# Altium project 200130 Precharge Controller R2.PrjPcb (part 1 of 2)
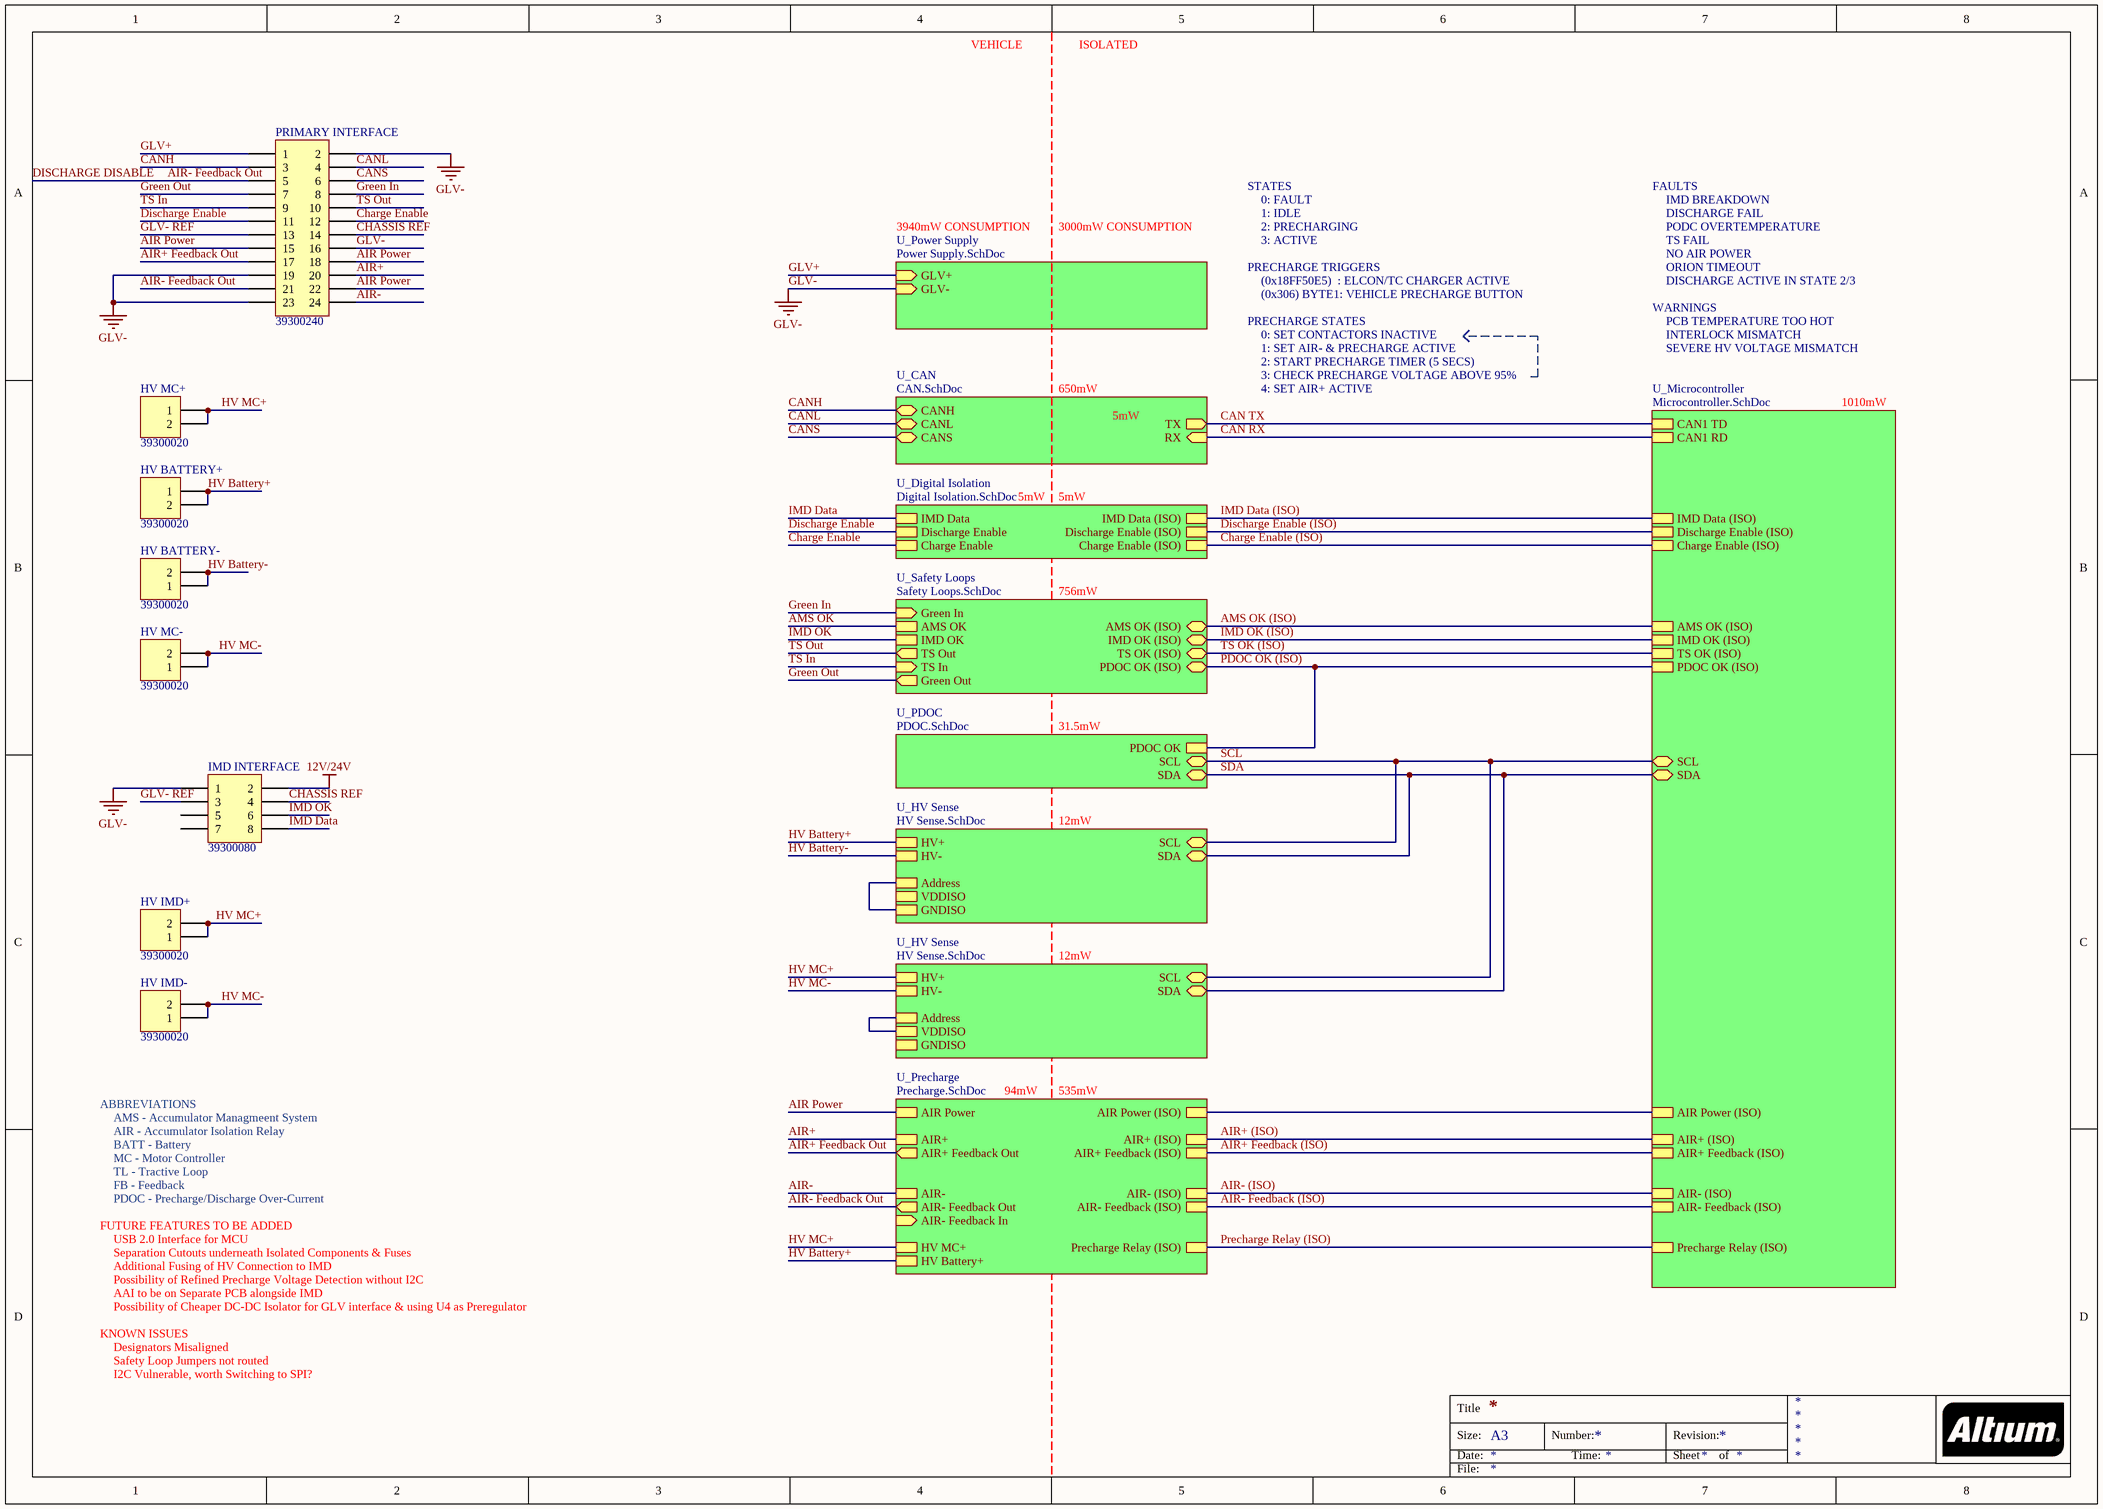
[diagram p0: Top Level.SchDoc]
9 sheets, 242 parts. Net scope: hierarchical (ports join the sheet entries above them; power ports are global).
Board file: 191228 PCB.PcbDoc
Sheets:
  Top Level.SchDoc
    U_CAN = CAN.SchDoc
    U_Power Supply = Power Supply.SchDoc
    U_Safety Loops = Safety Loops.SchDoc
    U_HV Sense = HV Sense.SchDoc
    U_HV Sense = HV Sense.SchDoc
    U_Precharge = Precharge.SchDoc
    U_PDOC = PDOC.SchDoc
    U_Digital Isolation = Digital Isolation.SchDoc
    U_Microcontroller = Microcontroller.SchDoc

## Sheet Top Level.SchDoc
size A3

### Parts
HV_BATTERY+  39300020  [39300020]
HV_BATTERY-  39300020  [39300020]
HV_IMD+  39300020  [39300020]
HV_IMD-  39300020  [39300020]
HV_MC+  39300020  [39300020]
HV_MC-  39300020  [39300020]
IMD_INTERFACE  39300080  [39300080]
PRIMARY_INTERFACE  39300240  [39300240]

### Sub-sheets
U_CAN = CAN.SchDoc: CANH (bidir), CANL (bidir), CANS (bidir), RX (in), TX (out)
U_Digital Isolation = Digital Isolation.SchDoc: IMD Data, Discharge Enable, Charge Enable, IMD Data (ISO), Discharge Enable (ISO), Charge Enable (ISO)
U_HV Sense = HV Sense.SchDoc: HV+, HV-, SCL (bidir), SDA (bidir), Address, VDDISO, GNDISO
U_HV Sense = HV Sense.SchDoc: HV+, HV-, SCL (bidir), SDA (bidir), Address, VDDISO, GNDISO
U_Microcontroller = Microcontroller.SchDoc: AIR- Feedback (ISO), AIR+ Feedback (ISO), AIR- (ISO), Precharge Relay (ISO), AIR+ (ISO), CAN1 TD, IMD OK (ISO), PDOC OK (ISO), AMS OK (ISO), TS OK (ISO), CAN1 RD, IMD Data (ISO), Discharge Enable (ISO), Charge Enable (ISO), SCL (bidir), SDA (bidir), AIR Power (ISO)
U_PDOC = PDOC.SchDoc: PDOC OK, SCL (bidir), SDA (bidir)
U_Power Supply = Power Supply.SchDoc: GLV+ (in), GLV- (in)
U_Precharge = Precharge.SchDoc: AIR Power, AIR- (ISO), AIR- Feedback Out (out), AIR- Feedback (ISO), AIR-, AIR- Feedback In (in), AIR+, AIR+ Feedback Out (out), AIR+ (ISO), AIR+ Feedback (ISO), Precharge Relay (ISO), HV MC+, HV Battery+, AIR Power (ISO)
U_Safety Loops = Safety Loops.SchDoc: AMS OK, IMD OK (ISO) (bidir), AMS OK (ISO) (bidir), PDOC OK (ISO) (bidir), TS OK (ISO) (bidir), Green In (in), IMD OK, TS Out (out), TS In (in), Green Out (out)

### Nets
12V/24V: IMD_INTERFACE.2
AIR Power: PRIMARY_INTERFACE.15 PRIMARY_INTERFACE.18 PRIMARY_INTERFACE.22 ; sheet U_Precharge/AIR Power
GLV-: IMD_INTERFACE.1 PRIMARY_INTERFACE.2 PRIMARY_INTERFACE.16 PRIMARY_INTERFACE.19 PRIMARY_INTERFACE.23 ; sheet U_Power Supply/GLV-
HV Battery-: HV_BATTERY-.1 HV_BATTERY-.2 HV_IMD-.1 HV_IMD-.2 HV_MC-.1 HV_MC-.2 ; sheet U_HV Sense/HV-, sheet U_HV Sense/Address, sheet U_HV Sense/GNDISO, sheet U_HV Sense/HV-, sheet U_HV Sense/GNDISO  [also labelled HV MC-]
TS In: PRIMARY_INTERFACE.9 ; sheet U_Safety Loops/TS In
VDDISO: sheet U_HV Sense/VDDISO, sheet U_HV Sense/Address, sheet U_HV Sense/VDDISO
AIR+: PRIMARY_INTERFACE.20 ; sheet U_Precharge/AIR+
AIR+ (ISO): sheet U_Precharge/AIR+ (ISO), sheet U_Microcontroller/AIR+ (ISO)
AIR+ Feedback (ISO): sheet U_Precharge/AIR+ Feedback (ISO), sheet U_Microcontroller/AIR+ Feedback (ISO)
AIR+ Feedback Out: PRIMARY_INTERFACE.17 ; sheet U_Precharge/AIR+ Feedback Out
AIR-: PRIMARY_INTERFACE.24 ; sheet U_Precharge/AIR-
AIR- (ISO): sheet U_Precharge/AIR- (ISO), sheet U_Microcontroller/AIR- (ISO)
AIR- Feedback (ISO): sheet U_Precharge/AIR- Feedback (ISO), sheet U_Microcontroller/AIR- Feedback (ISO)
AIR- Feedback Out: PRIMARY_INTERFACE.5 PRIMARY_INTERFACE.21 ; sheet U_Precharge/AIR- Feedback Out  [also labelled DISCHARGE DISABLE]
AMS OK: sheet U_Safety Loops/AMS OK
AMS OK (ISO): sheet U_Safety Loops/AMS OK (ISO), sheet U_Microcontroller/AMS OK (ISO)
CAN RX: sheet U_CAN/RX, sheet U_Microcontroller/CAN1 RD
CAN TX: sheet U_CAN/TX, sheet U_Microcontroller/CAN1 TD
CANH: PRIMARY_INTERFACE.3 ; sheet U_CAN/CANH
CANL: PRIMARY_INTERFACE.4 ; sheet U_CAN/CANL
CANS: PRIMARY_INTERFACE.6 ; sheet U_CAN/CANS
Charge Enable: PRIMARY_INTERFACE.12 ; sheet U_Digital Isolation/Charge Enable
Charge Enable (ISO): sheet U_Digital Isolation/Charge Enable (ISO), sheet U_Microcontroller/Charge Enable (ISO)
CHASSIS REF: IMD_INTERFACE.4 PRIMARY_INTERFACE.14
Discharge Enable: PRIMARY_INTERFACE.11 ; sheet U_Digital Isolation/Discharge Enable
Discharge Enable (ISO): sheet U_Digital Isolation/Discharge Enable (ISO), sheet U_Microcontroller/Discharge Enable (ISO)
GLV+: PRIMARY_INTERFACE.1 ; sheet U_Power Supply/GLV+
GLV- REF: IMD_INTERFACE.3 PRIMARY_INTERFACE.13
Green In: PRIMARY_INTERFACE.8 ; sheet U_Safety Loops/Green In
Green Out: PRIMARY_INTERFACE.7 ; sheet U_Safety Loops/Green Out
HV Battery+: HV_BATTERY+.1 HV_BATTERY+.2 ; sheet U_HV Sense/HV+, sheet U_Precharge/HV Battery+
HV MC+: HV_IMD+.1 HV_IMD+.2 HV_MC+.1 HV_MC+.2 ; sheet U_HV Sense/HV+, sheet U_Precharge/HV MC+
IMD Data: IMD_INTERFACE.8 ; sheet U_Digital Isolation/IMD Data
IMD Data (ISO): sheet U_Digital Isolation/IMD Data (ISO), sheet U_Microcontroller/IMD Data (ISO)
IMD OK: IMD_INTERFACE.6 ; sheet U_Safety Loops/IMD OK
IMD OK (ISO): sheet U_Safety Loops/IMD OK (ISO), sheet U_Microcontroller/IMD OK (ISO)
PDOC OK (ISO): sheet U_Safety Loops/PDOC OK (ISO), sheet U_PDOC/PDOC OK, sheet U_Microcontroller/PDOC OK (ISO)
Precharge Relay (ISO): sheet U_Precharge/Precharge Relay (ISO), sheet U_Microcontroller/Precharge Relay (ISO)
SCL: sheet U_HV Sense/SCL, sheet U_HV Sense/SCL, sheet U_PDOC/SCL, sheet U_Microcontroller/SCL
SDA: sheet U_HV Sense/SDA, sheet U_HV Sense/SDA, sheet U_PDOC/SDA, sheet U_Microcontroller/SDA
TS OK (ISO): sheet U_Safety Loops/TS OK (ISO), sheet U_Microcontroller/TS OK (ISO)
TS Out: PRIMARY_INTERFACE.10 ; sheet U_Safety Loops/TS Out
NetAIR_POW_TP1_1: sheet U_Precharge/AIR Power (ISO), sheet U_Microcontroller/AIR Power (ISO)

Not connected (* = marked no-connect by the designer): IMD_INTERFACE 5 7

### Notes on the sheet
- VEHICLE
- ISOLATED
- 3940mW CONSUMPTION
- 3000mW CONSUMPTION
- STATES
- 0: FAULT
- 1: IDLE
- 2: PRECHARGING
- 3: ACTIVE
- FAULTS
- IMD BREAKDOWN
- DISCHARGE FAIL
- PODC OVERTEMPERATURE
- TS FAIL
- PRECHARGE TRIGGERS
- (0x18FF50E5)  : ELCON/TC CHARGER ACTIVE
- (0x306) BYTE1: VEHICLE PRECHARGE BUTTON
- WARNINGS
- NO AIR POWER
- ORION TIMEOUT
- DISCHARGE ACTIVE IN STATE 2/3
- PRECHARGE STATES
- 1: SET AIR- & PRECHARGE ACTIVE
- 2: START PRECHARGE TIMER (5 SECS)
- 3: CHECK PRECHARGE VOLTAGE ABOVE 95%
- 0: SET CONTACTORS INACTIVE
- PCB TEMPERATURE TOO HOT
- INTERLOCK MISMATCH
- SEVERE HV VOLTAGE MISMATCH
- 650mW
- 5mW
- 4: SET AIR+ ACTIVE
- 1010mW
- 756mW
- 31.5mW
- 12mW
- ABBREVIATIONS
- AMS - Accumulator Managmeent System
- 94mW
- 535mW
- TL - Tractive Loop
- FB - Feedback
- BATT - Battery
- MC - Motor Controller
- AIR - Accumulator Isolation Relay
- FUTURE FEATURES TO BE ADDED
- PDOC - Precharge/Discharge Over-Current
- USB 2.0 Interface for MCU
- Separation Cutouts underneath Isolated Components & Fuses
- Additional Fusing of HV Connection to IMD
- Possibility of Refined Precharge Voltage Detection without I2C
- AAI to be on Separate PCB alongside IMD
- Possibility of Cheaper DC-DC Isolator for GLV interface & using U4 as Preregulator
- KNOWN ISSUES
- Designators Misaligned
- Safety Loop Jumpers not routed
- I2C Vulnerable, worth Switching to SPI?
- Title
- Size:
- Date:
- A3
- Number:
- Time:
- Revision:
- Sheet
- of
- File:

### Library data of the parts
HV_BATTERY+ HV_BATTERY- HV_IMD+ HV_IMD- HV_MC+ HV_MC- = 39300020: Positions: 2; Pitch: 4.2mm; Row Spacing: 5.5mm; Angle: 90; Flange: No; Contact: Tin; Part Number: 39300020; Digikey Part Number: WM21351-ND
IMD_INTERFACE = 39300080: Positions: 8; Pitch: 4.2mm; Row Spacing: 5.5mm; Angle: 90; Flange: No; Contact: Tin; Part Number: 39300080; Digikey Part Number: WM21354-ND
PRIMARY_INTERFACE = 39300240: Positions: 24; Pitch: 4.2mm; Row Spacing: 5.5mm; Angle: 90; Flange: No; Contact: Tin; Part Number: 39300240; Digikey Part Number: WM21362-ND

## Sheet CAN.SchDoc
size A4
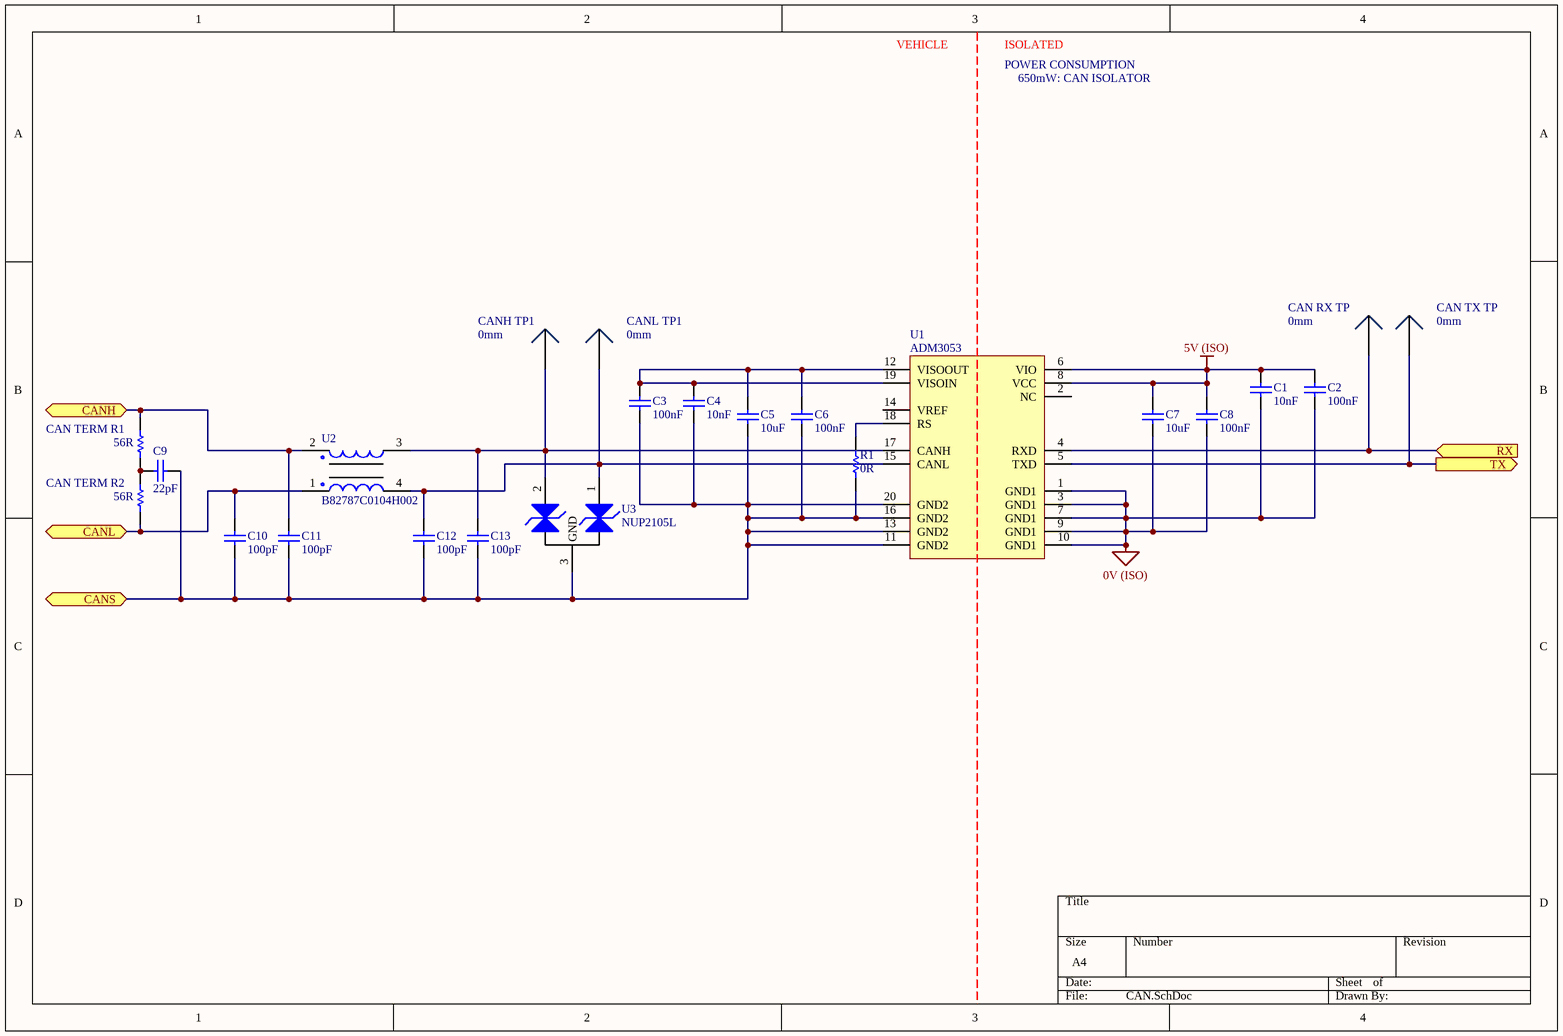
[diagram p1: CAN.SchDoc]

### Parts
C1  10nF  [1206]
C2  100nF  [0805]
C3  100nF  [0805]
C4  10nF  [1206]
C5  10uF  [0805]
C6  100nF  [0805]
C7  10uF  [0805]
C8  100nF  [0805]
C9  22pF  [0805]
C10  100pF  [0805]
C11  100pF  [0805]
C12  100pF  [0805]
C13  100pF  [0805]
CAN_RX_TP  0mm  [SMD Test Point]
CAN_TERM_R1  56R  [0805]
CAN_TERM_R2  56R  [0805]
CAN_TX_TP  0mm  [SMD Test Point]
CANH_TP1  0mm  [SMD Test Point]
CANL_TP1  0mm  [SMD Test Point]
R1  0R  [0805]
U1  ADM3053  [AD SOIC-W 20]
U2  B82787C0104H002  [TDK 4-PC Pad]
U3  NUP2105L  [ON SOT-23 BJT]

### Ports
CANH (bidir), CANL (bidir), CANS (bidir), RX (in), TX (out)

### Nets
0V (ISO): C1.1 C2.1 C7.1 C8.1 U1.1(GND1) U1.3(GND1) U1.7(GND1) U1.9(GND1) U1.10(GND1)
5V (ISO): C1.2 C2.2 C7.2 C8.2 U1.6(VIO) U1.8(VCC)
CAN RX: CAN_RX_TP.1 U1.4(RXD) ; port RX
CAN TX: CAN_TX_TP.1 U1.5(TXD) ; port TX
CANH: C11.2 CAN_TERM_R1.2 U2.2 ; port CANH
CANL: C10.2 CAN_TERM_R2.1 U2.1 ; port CANL
CANS: C3.1 C4.1 C5.1 C6.1 C9.1 C10.1 C11.1 C12.1 C13.1 R1.1 U1.11(GND2) U1.13(GND2) U1.16(GND2) U1.20(GND2) U3.3(GND) ; port CANS
NetC3_2: C3.2 C4.2 C5.2 C6.2 U1.12(VISOOUT) U1.19(VISOIN)
NetC9_2: C9.2 CAN_TERM_R1.1 CAN_TERM_R2.2
NetC12_2: C12.2 CANL_TP1.1 U1.15(CANL) U2.4 U3.1(CAN_H)
NetC13_2: C13.2 CANH_TP1.1 U1.17(CANH) U2.3 U3.2(CAN_L)
NetR1_2: R1.2 U1.18(RS)

Not connected (* = marked no-connect by the designer): U1 2(NC) 14(VREF)

### Notes on the sheet
- VEHICLE
- ISOLATED
- POWER CONSUMPTION
- 650mW: CAN ISOLATOR

### Library data of the parts
C1 C4 = GCM3195C2A103JA16D: Manufacturer: muRata; Tolerance: 5%; Material: Ceramic; Rated Voltage: 100V; Part Number: GCM3195C2A103JA16D; Value: 10nF; Digikey Part Number: 490-4978-2-ND
C2 C3 C6 C8 = GCM21BR71E104KA37L: Manufacturer: muRata; Tolerance: 10%; Material: X7R; Rated Voltage: 25V; Part Number: GCM21BR71E104KA37L; Value: 100nF
C5 C7 = GRM21BR6YA106KE43L: Manufacturer: muRata; Tolerance: 10%; Material: X5R; Rated Voltage: 50V; Part Number: GRM21BR6YA106KE43L; Value: 10uF; Digikey Part Number: 490-10514-6-ND
C9 = GCM21B5C1H220JA37L: Manufacturer: muRata; Tolerance: 5%; Material: C0G; Rated Voltage: 50V; Part Number: GCM21B5C1H220JA37L; Value: 22pF
C10-C13 = GCM21B5C1H101JA37L: Manufacturer: muRata; Tolerance: 5%; Material: C0G; Rated Voltage: 50V; Part Number: GCM21B5C1H101JA37L; Value: 100pF
CAN_RX_TP CAN_TX_TP CANH_TP1 CANL_TP1 = SMD Test Point: Positions: 1; Row Spacing: 0; Flange: No; Contact: NA; Part Number: SMD Test Point; Pitch: 0mm; Angle: 0
CAN_TERM_R1 CAN_TERM_R2 = RC0805FR0756RL: Manufacturer: YAGEO; Tolerance: 0.01; Rated Voltage: 0.125W; Part Number: RC0805FR0756RL; Value: 56R; Material: FR-07
R1 = RC0805FR070RL: Manufacturer: YAGEO; Tolerance: 0.01; Rated Voltage: 0.125W; Part Number: RC0805FR070RL; Value: 0R; Material: FR-07
U1 = ADM3053: Isolated CAN Transceiver; Manufacturer: Analogue Devices; Part Number: ADM3053; Digikey Part Number: ADM3053BRWZ-ND; Digikey Link: https://www.digikey.com/product-detail/en/analog-devices-inc/ADM3053BRWZ/ADM3053BRWZ-ND/2709332
U2 = B82787C0104H002: 100µH @ 100kHz 2 Line Common Mode Choke Surface Mount 5.8 kOhms @ 10MHz 150mA DCR 2Ohm; Manufacturer: EPCOS (TDK); Part Number: B82787C0104H002; Inductance: 100µH @ 100kHz; Impedence: 5.8 kOhms @ 10MHz; Material: Wirewound; Rated Current: 150mA; Digikey Part Number: 495-4598-1-ND; Digikey Link: https://www.digikey.com/product-detail/en/epcos-tdk/B82787C0104H002/495-4598-2-ND/3680998
U3 = NUP2105L: Dual Line CAN Bus Protector; Manufacturer: ON Semiconductor; Part Number: NUP2105L; Digikey Part Number: NUP2105LT1GOSCT-ND; Digikey Link: https://www.digikey.com/product-detail/en/on-semiconductor/NUP2105LT1G/NUP2105LT1GOSCT-ND/1485001

## Sheet Power Supply.SchDoc
size A4
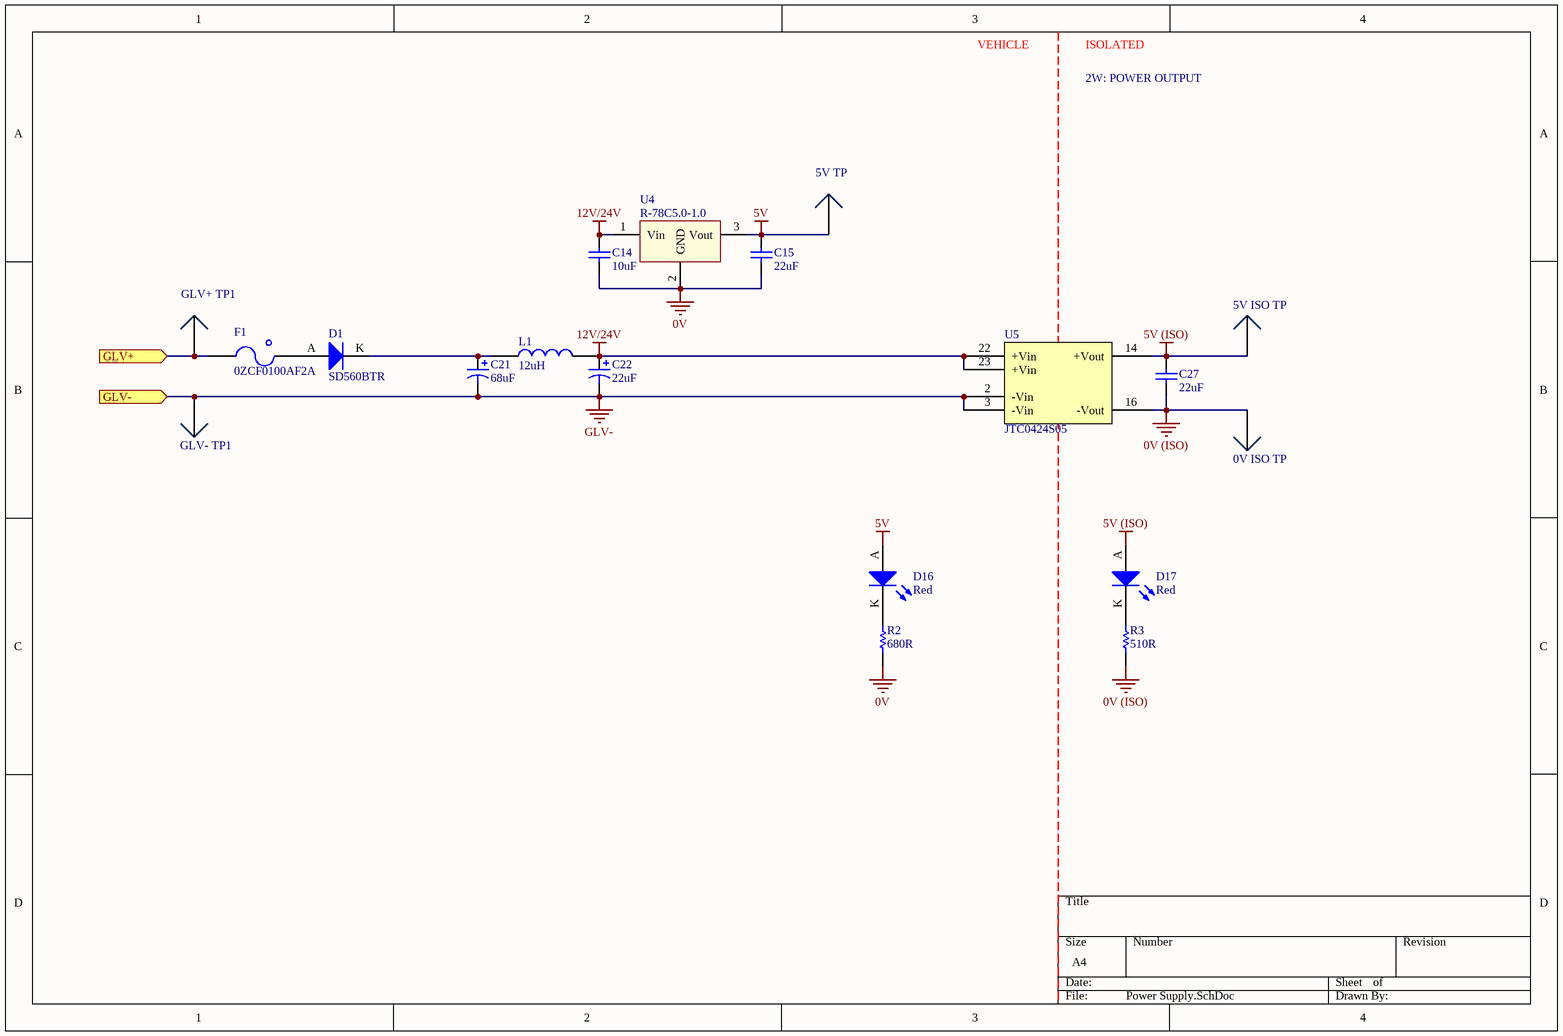
[diagram p2: Power Supply.SchDoc]

### Parts
0V_ISO_TP  0mm  [SMD Test Point]  (value not drawn)
5V_ISO_TP  0mm  [SMD Test Point]  (value not drawn)
5V_TP  0mm  [SMD Test Point]  (value not drawn)
C14  10uF  [0805]
C15  22uF  [1206]
C21  68uF  [2924]
C22  22uF  [2924]
C27  22uF  [1206]
D1  SD560BTR  [SMB Diode]
D16  Red  [0805 LED]
D17  Red  [0805 LED]
F1  0ZCF0100AF2A  [2920]
GLV+_TP1  0mm  [SMD Test Point]  (value not drawn)
GLV-_TP1  0mm  [SMD Test Point]  (value not drawn)
L1  12uH  [1812]
R2  680R  [0805]
R3  510R  [0805]
U4  R-78C5.0-1.0  [RECOM 3-SIP]
U5  JTC0424S05  [24-DIP Module, 7 Leads]

### Ports
GLV+ (in), GLV- (in)

### Nets
0V: C14.1 C15.1 R2.1 U4.2(GND)  [project net TS In]
0V (ISO): 0V_ISO_TP.1 C27.1 R3.1 U5.16(-Vout)
5V: 5V_TP.1 C15.2 D16.A U4.3(Vout)
5V (ISO): 5V_ISO_TP.1 C27.2 D17.A U5.14(+Vout)
12V/24V: C14.2 C22.2 L1.1 U4.1(Vin) U5.22(+Vin) U5.23(+Vin)
GLV-: C21.1 C22.1 GLV-_TP1.1 U5.2(-Vin) U5.3(-Vin) ; port GLV-
GLV+: F1.1 GLV+_TP1.1 ; port GLV+
NetC21_2: C21.2 D1.K L1.2
NetD1_A: D1.A F1.2
NetD16_K: D16.K R2.2
NetD17_K: D17.K R3.2

### Notes on the sheet
- VEHICLE
- ISOLATED
- 2W: POWER OUTPUT

### Library data of the parts
0V_ISO_TP 5V_ISO_TP 5V_TP GLV+_TP1 GLV-_TP1 = SMD Test Point: as CAN_RX_TP on sheet CAN; Part Number: SMD Test Point; Pitch: 0mm; Angle: 0
C14 = GRM21BR6YA106KE43L: as C5 on sheet CAN; Part Number: GRM21BR6YA106KE43L; Value: 10uF; Digikey Part Number: 490-10514-6-ND
C15 C27 = CC1206MKX5R7BB226: Manufacturer: YAGEO; Tolerance: 20%; Material: Ceramic; Rated Voltage: 16V; Part Number: CC1206MKX5R7BB226; Value: 22uF; Digikey Part Number: 311-1997-2-ND
C21 = TAJV686K035RNJ: Manufacturer: AVX Corporation; Tolerance: 10%; Material: Tantalum; Rated Voltage: 35V; Part Number: TAJV686K035RNJ; Value: 68uF; Digikey Part Number: 478-13135-1-ND
C22 = TAJV226K050RNJ: Manufacturer: AVX Corporation; Tolerance: 10%; Material: Tantalum; Rated Voltage: 50V; Part Number: TAJV226K050RNJ; Value: 22uF; Digikey Part Number: 478-5811-1-ND
D1 = SD560BTR: 1.2V_F 600V 5A SMB; Manufacturer: SMC Diode Solutions; Part Number: SD560BTR; Digikey Part Number: 1655-1530-2-ND; Digikey Link: https://www.digikey.com/product-detail/en/smc-diode-solutions/SD560BTR/1655-1530-2-ND/6022620
D16 D17 = SML-210LTT86: Red LED Indication - Discrete 1.75V 0805 (2012 Metric); Manufacturer: ROHM Semiconductor; Part Number: SML-210LTT86; Colour: Red; Digikey Part Number: 511-1286-1-ND; Digikey Link: https://www.digikey.com/product-detail/en/rohm-semiconductor/SML-210LTT86/511-1286-1-ND/637099
F1 = 0ZCF0100AF2A: PTC RESET FUSE 60V 1A 292; Manufacturer: Littelfuse Inc.; Part Number: 0ZCF0100AF2A; Digikey Part Number: 507-2070-1-ND; Digikey Link: https://www.digikey.com/product-detail/en/bel-fuse-inc/0ZCF0100AF2A/507-2070-1-ND/6210547
L1 = RLS-126: Manufacturer: Recom; Impedence: 230mOhm; Tolerance: 0.2; Material: Wirewound; Rated Current: 800mA; Part Number: RLS-126; Inductance: 12uH; Digikey Part Number: 945-3429-ND
R2 = RC0805FR07680RL: Manufacturer: YAGEO; Tolerance: 0.01; Rated Voltage: 0.125W; Part Number: RC0805FR07680RL; Value: 680R; Material: FR-07
R3 = RC0805FR07510RL: Manufacturer: YAGEO; Tolerance: 0.01; Rated Voltage: 0.125W; Part Number: RC0805FR07510RL; Value: 510R; Material: FR-07
U4 = R-78C5.0-1.0: CONV DC/DC 1A 5V OUT SIP VERT; Manufacturer: Recom; Isolation: Non-Isolated; Part Number: R-78C5.0-1.0; Digikey Part Number: 945-1395-5-ND; Digikey Link: https://www.digikey.com.au/product-detail/en/recom-power/R-78C5.0-1.0/945-1395-5-ND/2652148
U5 = JTC0424S05: DC DC CONVERTER 5V 4W; Manufacturer: XP Power; Input Voltage: 9V-36V; Efficiency: 0.79; Isolation: Isolated; Part Number: JTC0424S05; Output Voltage: 5V; Output Power: 4W; Digikey Part Number: JTC0424S05-ND; Digikey Link: https://www.digikey.com/products/en?keywords=%20JTC0424S05

## Sheet Safety Loops.SchDoc
size A3 portrait
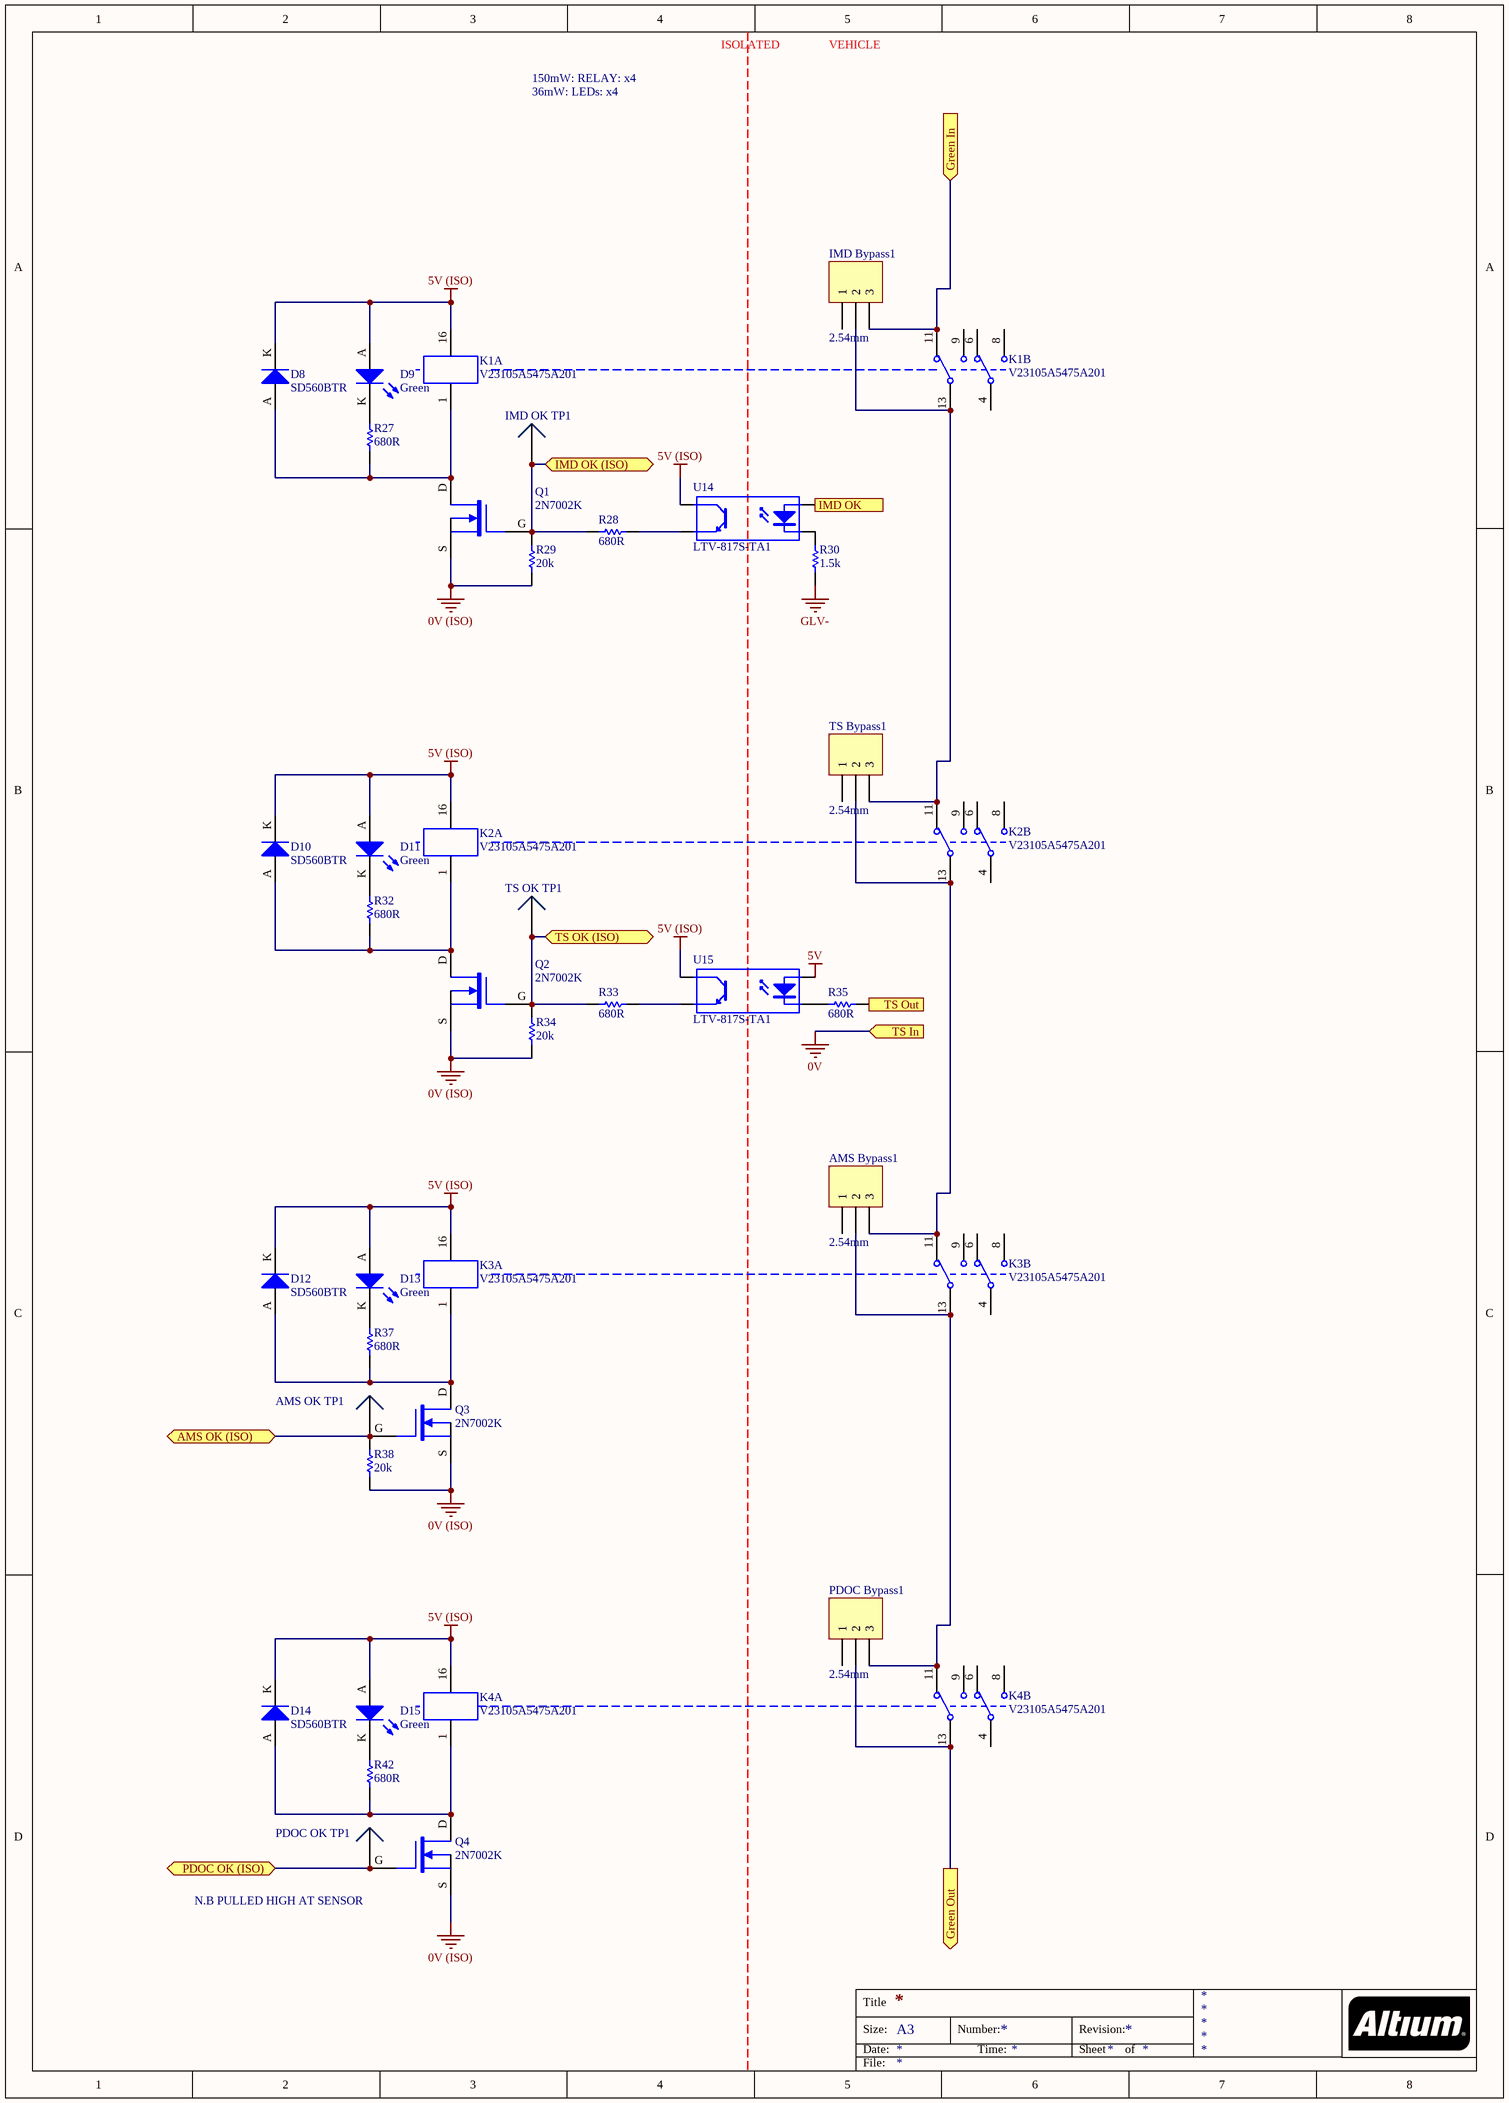
[diagram p3: Safety Loops.SchDoc]

### Parts
AMS_Bypass1  2.54mm  [TH 2.54mm Header 1x3]
AMS_OK_TP1  0mm  [SMD Test Point]  (value not drawn)
D8  SD560BTR  [SMB Diode]
D9  Green  [0805 LED]
D10  SD560BTR  [SMB Diode]
D11  Green  [0805 LED]
D12  SD560BTR  [SMB Diode]
D13  Green  [0805 LED]
D14  SD560BTR  [SMB Diode]
D15  Green  [0805 LED]
IMD_Bypass1  2.54mm  [TH 2.54mm Header 1x3]
IMD_OK_TP1  0mm  [SMD Test Point]  (value not drawn)
K1  V23105A5475A201  [TI 2-DIL]  (parts A,B of 2)
K2  V23105A5475A201  [TI 2-DIL]  (parts A,B of 2)
K3  V23105A5475A201  [TI 2-DIL]  (parts A,B of 2)
K4  V23105A5475A201  [TI 2-DIL]  (parts A,B of 2)
PDOC_Bypass1  2.54mm  [TH 2.54mm Header 1x3]
PDOC_OK_TP1  0mm  [SMD Test Point]  (value not drawn)
Q1  2N7002K  [SOT-343_N]
Q2  2N7002K  [SOT-343_N]
Q3  2N7002K  [SOT-343_N]
Q4  2N7002K  [SOT-343_N]
R27  680R  [0805]
R28  680R  [0805]
R29  20k  [0805]
R30  1.5k  [0805]
R32  680R  [0805]
R33  680R  [0805]
R34  20k  [0805]
R35  680R  [0805]
R37  680R  [0805]
R38  20k  [0805]
R42  680R  [0805]
TS_Bypass1  2.54mm  [TH 2.54mm Header 1x3]
TS_OK_TP1  0mm  [SMD Test Point]  (value not drawn)
U14  LTV-817S-TA1  [ON 4-SMD]
U15  LTV-817S-TA1  [ON 4-SMD]

### Ports
AMS OK (ISO) (bidir), Green In (in), Green Out (out), IMD OK, IMD OK (ISO) (bidir), PDOC OK (ISO) (bidir), TS In (in), TS OK (ISO) (bidir), TS Out (out)

### Nets
0V (ISO): Q1.S Q2.S Q3.S Q4.S R29.1 R34.1 R38.1
5V: U15.1(A)
5V (ISO): D8.K D9.A D10.K D11.A D12.K D13.A D14.K D15.A K1.16 K2.16 K3.16 K4.16 U14.4(C) U15.4(C)
GLV-: R30.1
AMS OK (ISO): AMS_OK_TP1.1 Q3.G R38.2 ; port AMS OK (ISO)
Green In: IMD_Bypass1.3 K1.11 ; port Green In
Green Out: K4.13 PDOC_Bypass1.2 ; port Green Out
IMD OK: U14.1(A) ; port IMD OK
IMD OK (ISO): IMD_OK_TP1.1 Q1.G R28.1 R29.2 ; port IMD OK (ISO)
PDOC OK (ISO): PDOC_OK_TP1.1 Q4.G ; port PDOC OK (ISO)
TS OK (ISO): Q2.G R33.1 R34.2 TS_OK_TP1.1 ; port TS OK (ISO)
TS Out: R35.2 ; port TS Out
NetAMS_Bypass1_2: AMS_Bypass1.2 K3.13 K4.11 PDOC_Bypass1.3
NetAMS_Bypass1_3: AMS_Bypass1.3 K2.13 K3.11 TS_Bypass1.2
NetD8_A: D8.A K1.1 Q1.D R27.1
NetD9_K: D9.K R27.2
NetD10_A: D10.A K2.1 Q2.D R32.1
NetD11_K: D11.K R32.2
NetD12_A: D12.A K3.1 Q3.D R37.1
NetD13_K: D13.K R37.2
NetD14_A: D14.A K4.1 Q4.D R42.1
NetD15_K: D15.K R42.2
NetIMD_Bypass1_2: IMD_Bypass1.2 K1.13 K2.11 TS_Bypass1.3
NetR28_2: R28.2 U14.3(E)
NetR30_2: R30.2 U14.2(K)
NetR33_2: R33.2 U15.3(E)
NetR35_1: R35.1 U15.2(K)

Not connected (* = marked no-connect by the designer): AMS_Bypass1 1; IMD_Bypass1 1; K1 4 6 8 9; K2 4 6 8 9; K3 4 6 8 9; K4 4 6 8 9; PDOC_Bypass1 1; TS_Bypass1 1

### Notes on the sheet
- 150mW: RELAY: x4
- 36mW: LEDs: x4
- ISOLATED
- VEHICLE
- N.B PULLED HIGH AT SENSOR
- Title
- Size:
- Date:
- A3
- Number:
- Time:
- Revision:
- Sheet
- of
- File:

### Library data of the parts
AMS_Bypass1 IMD_Bypass1 PDOC_Bypass1 TS_Bypass1 = TH 2.54mm Header 1x3: Positions: 3; Angle: 0; Flange: No; Contact: NA; Part Number: TH 2.54mm Header 1x3; Pitch: 2.54mm; Row Spacing: 2.54mm
AMS_OK_TP1 IMD_OK_TP1 PDOC_OK_TP1 TS_OK_TP1 = SMD Test Point: as CAN_RX_TP on sheet CAN; Part Number: SMD Test Point; Pitch: 0mm; Angle: 0
D8 D10 D12 D14 = SD560BTR: as D1 on sheet Power Supply; Part Number: SD560BTR; Digikey Part Number: 1655-1530-2-ND; Digikey Link: https://www.digikey.com/product-detail/en/smc-diode-solutions/SD560BTR/1655-1530-2-ND/6022620
D9 D11 D13 D15 = SML-210FTT86: Green LED Indication - Discrete 1.75V 0805 (2012 Metric); Manufacturer: ROHM Semiconductor; Part Number: SML-210FTT86; Colour: Green; Digikey Part Number: 511-1285-1-ND; Digikey Link: https://www.digikey.com/product-detail/en/rohm-semiconductor/SML-210FTT86/511-1285-1-ND/637098
K1-K4 = V23105A5475A201: 5V DPDT Relay 3A 220VDC; Manufacturer: Axicom; Part Number: V23105A5475A201; Digikey Part Number: PB383-ND; Digikey Link: https://www.digikey.com/products/en?mpart=V23105A5001A201&v=41
Q1-Q4 = 2N7002K: 60V 380mA, NFET MOSTFET (Small Signal); Manufacturer: ON Semiconductor; Published: 24-Mar-1999; LatestRevisionDate: 29-May-2009; LatestRevisionNote: IPC-7351 Footprint Added.; PackageVersion: Sep-2000; PackageReference: SOT-343; Publisher: Altium Limited; PackageDescription: 4-Pin SOT-343 Package 1.3 mm Pitch, 2.1 mm Lead Span; Part Number: 2N7002K; Digikey Part Number: 2N7002KCT-ND; Digikey Link: https://www.digikey.com/product-detail/en/on-semiconductor/2N7002K/2N7002KCT-ND/2060375; Qty: 30
R27 R28 R32 R33 R35 R37 R42 = RC0805FR07680RL: as R2 on sheet Power Supply; Part Number: RC0805FR07680RL; Value: 680R; Material: FR-07
R29 R34 R38 = RC0805FR0720KL: Manufacturer: YAGEO; Tolerance: 0.01; Rated Voltage: 0.125W; Part Number: RC0805FR0720KL; Value: 20k; Material: FR-07
R30 = RC0805FR071K5L: Manufacturer: YAGEO; Tolerance: 0.01; Rated Voltage: 0.125W; Part Number: RC0805FR071K5L; Value: 1.5k; Material: FR-07
U14 U15 = LTV-817S-TA1: 35V 50ma Optocoupler (VF=1.2V); Manufacturer: Lite-On Inc; Part Number: LTV-817S-TA1; Digikey Part Number: 160-1893-2-ND; Digikey Link: https://www.digikey.com/product-detail/en/lite-on-inc/LTV-817S-TA1/160-1893-2-ND/388451

## Sheet HV Sense.SchDoc
size A4
Used 2 times, as channels U_HV Sense, U_HV Sense. Parts and nets are listed once, with the designators drawn on the sheet.
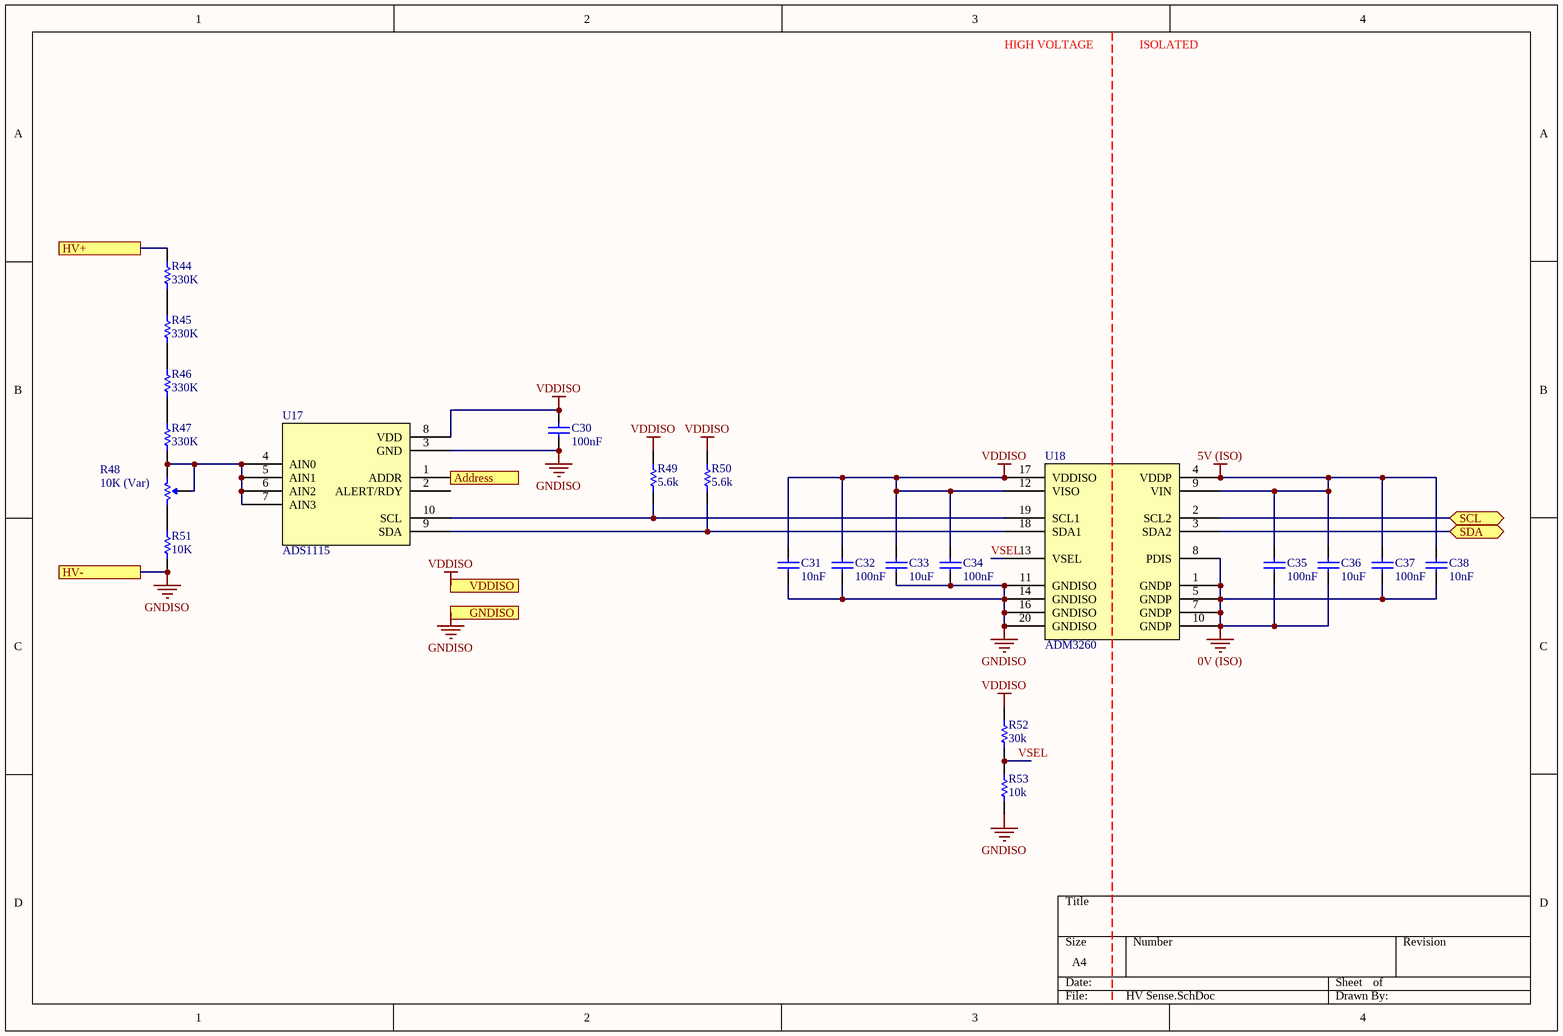
[diagram p4: HV Sense.SchDoc]

### Parts
C30  100nF  [0805]
C31  10nF  [0805]
C32  100nF  [0805]
C33  10uF  [0805]
C34  100nF  [0805]
C35  100nF  [0805]
C36  10uF  [0805]
C37  100nF  [0805]
C38  10nF  [0805]
R44  330K  [VB 0204]
R45  330K  [VB 0204]
R46  330K  [VB 0204]
R47  330K  [VB 0204]
R48  10K (Var)  [B 3296]
R49  5.6k  [0805]
R50  5.6k  [0805]
R51  10K  [VB 0204]
R52  30k  [0805]
R53  10k  [0805]
U17  ADS1115  [TI 10-VSSOP]
U18  ADM3260  [AD 20-SSOP]

### Ports
Address, GNDISO, HV+, HV-, SCL (bidir), SDA (bidir), VDDISO

### Nets
0V (ISO): C35.1 C36.1 C37.1 C38.1 U18.1(GNDP) U18.5(GNDP) U18.7(GNDP) U18.8(PDIS) U18.10(GNDP)
5V (ISO): C35.2 C36.2 C37.2 C38.2 U18.4(VDDP) U18.9(VIN)
GNDISO: C30.2 C31.1 C32.1 C33.1 C34.2 R51.1 R53.1 U17.3(GND) U18.11(GNDISO) U18.14(GNDISO) U18.16(GNDISO) U18.20(GNDISO) ; port HV-, port GNDISO
VDDISO: C30.1 C31.2 C32.2 C33.2 C34.1 R49.2 R50.2 R52.2 U17.8(VDD) U18.12(VISO) U18.17(VDDISO) ; port VDDISO
Address: U17.1(ADDR) ; port Address
HV+: R44.2 ; port HV+
SCL: U18.2(SCL2) ; port SCL
SDA: U18.3(SDA2) ; port SDA
VSEL: R52.1 R53.2 U18.13(VSEL)
NetR44_1: R44.1 R45.2
NetR45_1: R45.1 R46.2
NetR46_1: R46.1 R47.2
NetR47_1: R47.1 R48.2(Wiper) R48.3(CW) U17.4(AIN0) U17.5(AIN1) U17.6(AIN2) U17.7(AIN3)
NetR48_1: R48.1(CCW) R51.2
NetR49_1: R49.1 U17.10(SCL) U18.19(SCL1)
NetR50_1: R50.1 U17.9(SDA) U18.18(SDA1)

Not connected (* = marked no-connect by the designer): U17 2(ALERT/RDY)

### Channels
U_HV Sense: designators end in _U_HV_Sense#1; ports Address=HV Battery- GNDISO=HV Battery- HV+=HV Battery+ HV-=HV Battery- SCL=SCL SDA=SDA VDDISO=VDDISO
U_HV Sense: designators end in _U_HV_Sense#2; ports Address=VDDISO GNDISO=HV Battery- HV+=HV MC+ HV-=HV Battery- SCL=SCL SDA=SDA VDDISO=VDDISO

### Notes on the sheet
- HIGH VOLTAGE
- ISOLATED

### Library data of the parts
C30 C32 C34 C35 C37 = GCM21BR71E104KA37L: as C2 on sheet CAN; Part Number: GCM21BR71E104KA37L; Value: 100nF
C31 C38 = GCM21BR71H103KA37L: Manufacturer: muRata; Tolerance: 10%; Material: X7R; Rated Voltage: 50V; Part Number: GCM21BR71H103KA37L; Value: 10nF
C33 C36 = GRM21BR6YA106KE43L: as C5 on sheet CAN; Part Number: GRM21BR6YA106KE43L; Value: 10uF; Digikey Part Number: 490-10514-6-ND
R44-R47 = MMA02040C3303FB300: Manufacturer: Vishay Beyschlag; Tolerance: 0.01; Rated Voltage: 0.4W; Part Number: MMA02040C3303FB300; Value: 330K; Digikey Part Number: MMA-330KACT-ND
R48 = 3296W-1-103LF: Manufacturer: Bournes Inc; Tolerance: 0.1; Rated Voltage: 0.5W; Part Number: 3296W-1-103LF; Value: 10K (Var); Digikey Part Number: 3296W-103LF-ND
R49 R50 = RC0805FR075K6L: Manufacturer: YAGEO; Tolerance: 0.01; Rated Voltage: 0.125W; Part Number: RC0805FR075K6L; Value: 5.6k; Material: FR-07
R51 = MMA02040C1002FB300: Manufacturer: Vishay Beyschlag; Tolerance: 0.01; Rated Voltage: 0.4W; Part Number: MMA02040C1002FB300; Value: 10K; Digikey Part Number: MMA-10KACT-ND
R52 = RC0805FR0730KL: Manufacturer: YAGEO; Tolerance: 0.01; Rated Voltage: 0.125W; Part Number: RC0805FR0730KL; Value: 30k; Material: FR-07
R53 = RC0805FR0710KL: Manufacturer: YAGEO; Tolerance: 0.01; Rated Voltage: 0.125W; Part Number: RC0805FR0710KL; Value: 10k; Material: FR-07
U17 = ADS1115: 16 Bit Analog to Digital Converter 2, 4 Input 1 Sigma-Delta 10-VSSOP; Manufacturer: Texas Instruments; Part Number: ADS1115; Digikey Part Number: 296-38849-1-ND; Digikey Link: https://www.digikey.com/product-detail/en/texas-instruments/ADS1115IDGSR/296-38849-1-ND/5142969
U18 = ADM3260: I²C Digital Isolator 2500Vrms 2 Channel 25kV/µs CMTI 20-SSOP (0.209", 5.30mm Width); Manufacturer: Analog Devices; Part Number: ADM3260; Digikey Part Number: ADM3260ARSZ-RL7CT-ND; Digikey Link: https://www.digikey.com/product-detail/en/analog-devices-inc/ADM3260ARSZ-RL7/ADM3260ARSZ-RL7CT-ND/5233040

## Sheet Precharge.SchDoc
size A3
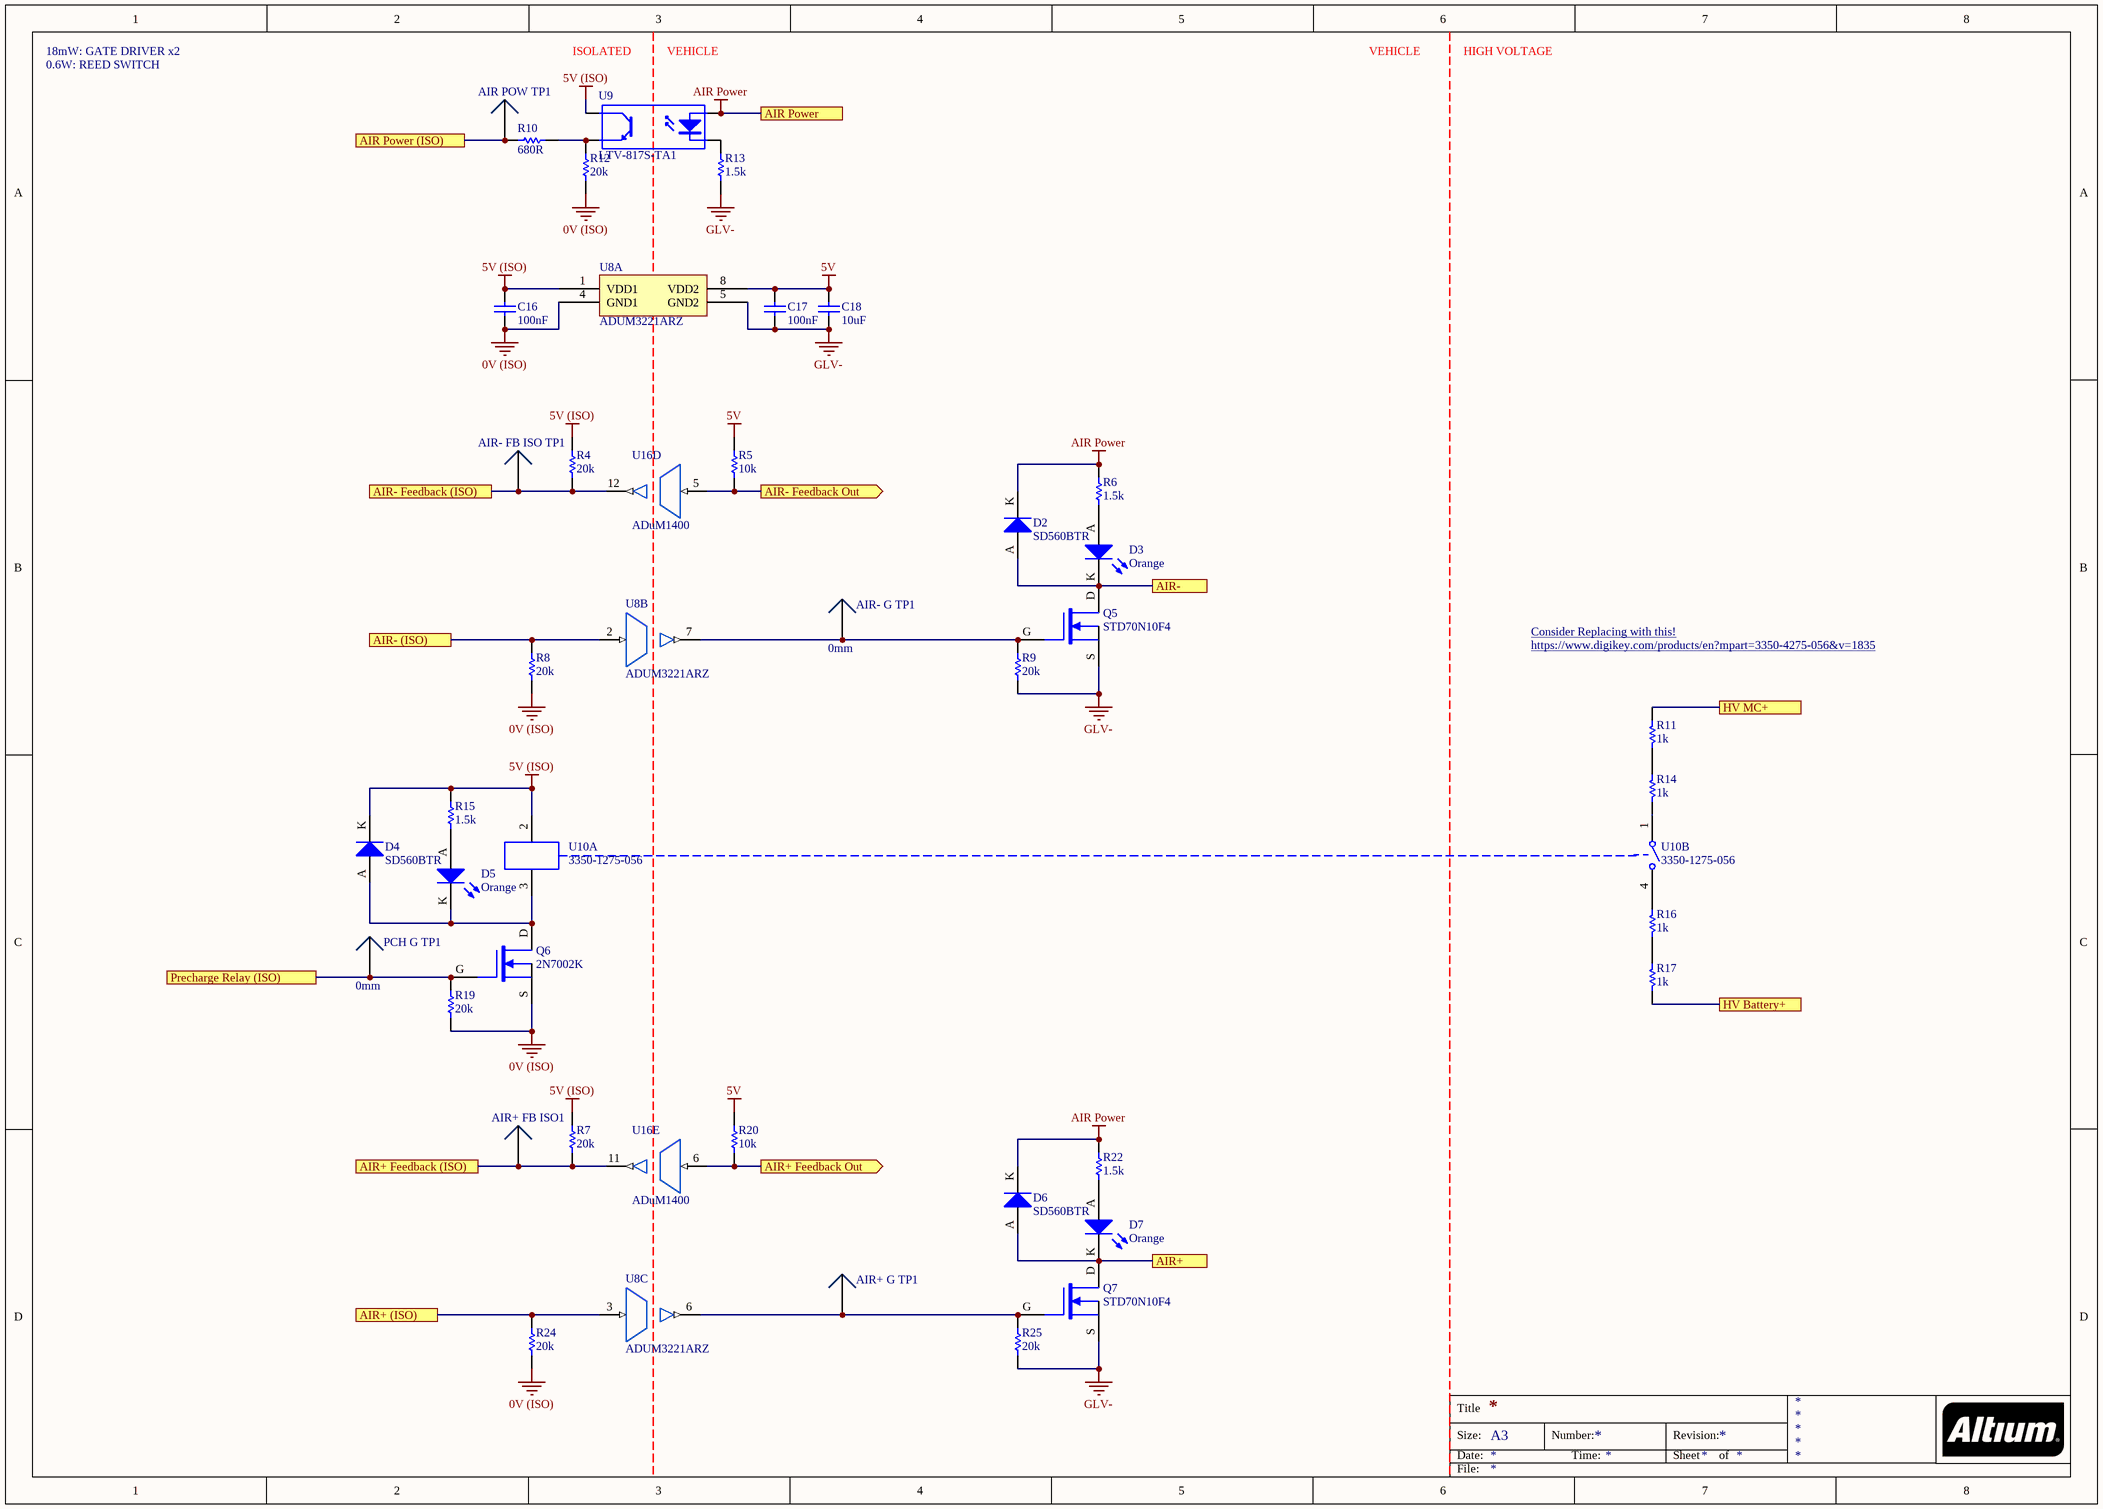
[diagram p5: Precharge.SchDoc]

### Parts
AIR+_FB_ISO1  0mm  [SMD Test Point]  (value not drawn)
AIR+_G_TP1  0mm  [SMD Test Point]  (value not drawn)
AIR-_FB_ISO_TP1  0mm  [SMD Test Point]  (value not drawn)
AIR-_G_TP1  0mm  [SMD Test Point]
AIR_POW_TP1  0mm  [SMD Test Point]  (value not drawn)
C16  100nF  [0805]
C17  100nF  [0805]
C18  10uF  [0805]
D2  SD560BTR  [SMB Diode]
D3  Orange  [0805 LED]
D4  SD560BTR  [SMB Diode]
D5  Orange  [0805 LED]
D6  SD560BTR  [SMB Diode]
D7  Orange  [0805 LED]
PCH_G_TP1  0mm  [SMD Test Point]
Q5  STD70N10F4  [SOT-343_N]
Q6  2N7002K  [SOT-343_N]
Q7  STD70N10F4  [SOT-343_N]
R4  20k  [0805]
R5  10k  [0805]
R6  1.5k  [0805]
R7  20k  [0805]
R8  20k  [0805]
R9  20k  [0805]
R10  680R  [0805]
R11  1k  [B TO-263]
R12  20k  [0805]
R13  1.5k  [0805]
R14  1k  [B TO-263]
R15  1.5k  [0805]
R16  1k  [B TO-263]
R17  1k  [B TO-263]
R19  20k  [0805]
R20  10k  [0805]
R22  1.5k  [0805]
R24  20k  [0805]
R25  20k  [0805]
U8  ADUM3221ARZ  [AD 8-SOIC]  (parts A,B,C of 3)
U9  LTV-817S-TA1  [ON 4-SMD]
U10  3350-1275-056  [CI SPST]  (parts A,B of 2)
U16  ADuM1400  [AD 16-SOIC]  (parts D,E of 5)

### Ports
AIR Power, AIR Power (ISO), AIR+, AIR+ (ISO), AIR+ Feedback (ISO), AIR+ Feedback Out (out), AIR-, AIR- (ISO), AIR- Feedback (ISO), AIR- Feedback Out (out), HV Battery+, HV MC+, Precharge Relay (ISO)

### Nets
0V (ISO): C16.1 Q6.S R8.1 R12.1 R19.1 R24.1 U8.4(GND1)
5V: C17.2 C18.2 R5.2 R20.2 U8.8(VDD2)
5V (ISO): C16.2 D4.K R4.2 R7.2 R15.2 U8.1(VDD1) U9.4(C) U10.2
AIR Power: D2.K D6.K R6.2 R22.2 U9.1(A) ; port AIR Power
GLV-: C17.1 C18.1 Q5.S Q7.S R9.1 R13.2 R25.1 U8.5(GND2)
AIR+: D6.A D7.K Q7.D ; port AIR+
AIR+ (ISO): R24.2 U8.3(VIA) ; port AIR+ (ISO)
AIR+ Feedback (ISO): AIR+_FB_ISO1.1 R7.1 U16.11(VOD) ; port AIR+ Feedback (ISO)
AIR+ Feedback Out: R20.1 U16.6(VID) ; port AIR+ Feedback Out
AIR-: D2.A D3.K Q5.D ; port AIR-
AIR- (ISO): R8.2 U8.2(VIA) ; port AIR- (ISO)
AIR- Feedback (ISO): AIR-_FB_ISO_TP1.1 R4.1 U16.12(VOC) ; port AIR- Feedback (ISO)
AIR- Feedback Out: R5.1 U16.5(VIC) ; port AIR- Feedback Out
HV Battery+: R17.1 ; port HV Battery+
HV MC+: R11.2 ; port HV MC+
Precharge Relay (ISO): PCH_G_TP1.1 Q6.G R19.2 ; port Precharge Relay (ISO)
NetAIR+_G_TP1_1: AIR+_G_TP1.1 Q7.G R25.2 U8.6(VOA)
NetAIR-_G_TP1_1: AIR-_G_TP1.1 Q5.G R9.2 U8.7(VOA)
NetAIR_POW_TP1_1: AIR_POW_TP1.1 R10.1 ; port AIR Power (ISO)
NetD3_A: D3.A R6.1
NetD4_A: D4.A D5.K Q6.D U10.3
NetD5_A: D5.A R15.1
NetD7_A: D7.A R22.1
NetR10_2: R10.2 R12.2 U9.3(E)
NetR11_1: R11.1 R14.2
NetR13_1: R13.1 U9.2(K)
NetR14_1: R14.1 U10.1
NetR16_1: R16.1 R17.2
NetR16_2: R16.2 U10.4

### Notes on the sheet
- 18mW: GATE DRIVER x2
- 0.6W: REED SWITCH
- ISOLATED
- VEHICLE
- HIGH VOLTAGE
- https://www.digikey.com/products/en?mpart=3350-4275-056&v=1835
- Consider Replacing with this! <https://www.digikey.com/products/en?mpart=3350-4275-056&v=1835>
- Title
- Size:
- Date:
- A3
- Number:
- Time:
- Revision:
- Sheet
- of
- File:

### Library data of the parts
AIR+_FB_ISO1 AIR+_G_TP1 AIR-_FB_ISO_TP1 AIR-_G_TP1 AIR_POW_TP1 PCH_G_TP1 = SMD Test Point: as CAN_RX_TP on sheet CAN; Part Number: SMD Test Point; Pitch: 0mm; Angle: 0
C16 C17 = GCM21BR71E104KA37L: as C2 on sheet CAN; Part Number: GCM21BR71E104KA37L; Value: 100nF
C18 = GRM21BR6YA106KE43L: as C5 on sheet CAN; Part Number: GRM21BR6YA106KE43L; Value: 10uF; Digikey Part Number: 490-10514-6-ND
D2 D4 D6 = SD560BTR: as D1 on sheet Power Supply; Part Number: SD560BTR; Digikey Part Number: 1655-1530-2-ND; Digikey Link: https://www.digikey.com/product-detail/en/smc-diode-solutions/SD560BTR/1655-1530-2-ND/6022620
D3 D5 D7 = SML-211DTT86: Orange LED Indication - Discrete 1.75V 0805 (2012 Metric); Manufacturer: ROHM Semiconductor; Part Number: SML-211DTT86; Colour: Orange; Digikey Part Number: 511-1291-1-ND; Digikey Link: https://www.digikey.com/product-detail/en/rohm-semiconductor/SML-211DTT86/511-1291-1-ND/637104
Q5 Q7 = STD70N10F4: N-Channel 100V 60A (Tc) 125W (Tc) Surface Mount DPAK; Manufacturer: STMicroelectronics; Published: 24-Mar-1999; LatestRevisionDate: 29-May-2009; LatestRevisionNote: IPC-7351 Footprint Added.; PackageVersion: Sep-2000; PackageReference: SOT-343; Publisher: Altium Limited; PackageDescription: 4-Pin SOT-343 Package 1.3 mm Pitch, 2.1 mm Lead Span; Part Number: STD70N10F4; Digikey Part Number: 497-8806-2-ND; Digikey Link: https://www.digikey.com/product-detail/en/stmicroelectronics/STD70N10F4/497-8806-2-ND/2035599
Q6 = 2N7002K: as Q1 on sheet Safety Loops; Published: 24-Mar-1999; LatestRevisionDate: 29-May-2009; LatestRevisionNote: IPC-7351 Footprint Added.; PackageVersion: Sep-2000; PackageReference: SOT-343; Publisher: Altium Limited; PackageDescription: 4-Pin SOT-343 Package 1.3 mm Pitch, 2.1 mm Lead Span; Part Number: 2N7002K; Digikey Part Number: 2N7002KCT-ND; Digikey Link: https://www.digikey.com/product-detail/en/on-semiconductor/2N7002K/2N7002KCT-ND/2060375; Qty: 30
R4 R7-R9 R12 R19 R24 R25 = RC0805FR0720KL: as R29 on sheet Safety Loops; Part Number: RC0805FR0720KL; Value: 20k; Material: FR-07
R5 R20 = RC0805FR0710KL: as R53 on sheet HV Sense; Part Number: RC0805FR0710KL; Value: 10k; Material: FR-07
R6 R13 R15 R22 = RC0805FR071K5L: as R30 on sheet Safety Loops; Part Number: RC0805FR071K5L; Value: 1.5k; Material: FR-07
R10 = RC0805FR07680RL: as R2 on sheet Power Supply; Part Number: RC0805FR07680RL; Value: 680R; Material: FR-07
R11 R14 R16 R17 = PWR263S-35-1001J: Manufacturer: Bournes Inc; Tolerance: 0.05; Rated Voltage: 35W; Part Number: PWR263S-35-1001J; Value: 1k; Digikey Part Number: PWR263S-35-1001J-ND
U8 = ADUM3221ARZ: 4A Gate Driver Magnetic Coupling 2500Vrms 2 Channel 8-SOIC; Manufacturer: Analog Devices; Part Number: ADUM3221ARZ; Digikey Part Number: ADUM3221ARZ-ND; Digikey Link: https://www.digikey.com/product-detail/en/analog-devices-inc/ADUM3221ARZ/ADUM3221ARZ-ND/2616333
U9 = LTV-817S-TA1: as U14 on sheet Safety Loops; Part Number: LTV-817S-TA1; Digikey Part Number: 160-1893-2-ND; Digikey Link: https://www.digikey.com/product-detail/en/lite-on-inc/LTV-817S-TA1/160-1893-2-ND/388451
U10 = 3350-1275-056: RELAY REED HV SPST 200W 3A 5V (NO); Manufacturer: Comus International; Part Number: 3350-1275-056; Digikey Part Number: 1835-1036-ND; Digikey Link: https://www.digikey.com.au/product-detail/en/comus-international/3350-1275-056/1835-1036-ND/7515918
U16 = ADuM1400: General Purpose Digital Isolator 2500Vrms 4 Channel 1Mbps 25kV/µs CMTI 16-SOIC (0.295", 7.50mm Width); Manufacturer: Analog Devices; Part Number: ADuM1400; Digikey Part Number: ADUM1400WSRWZ-ND; Digikey Link: https://www.digikey.com/product-detail/en/analog-devices-inc/ADUM1400WSRWZ/ADUM1400WSRWZ-ND/1873713

## Sheet PDOC.SchDoc
size A4
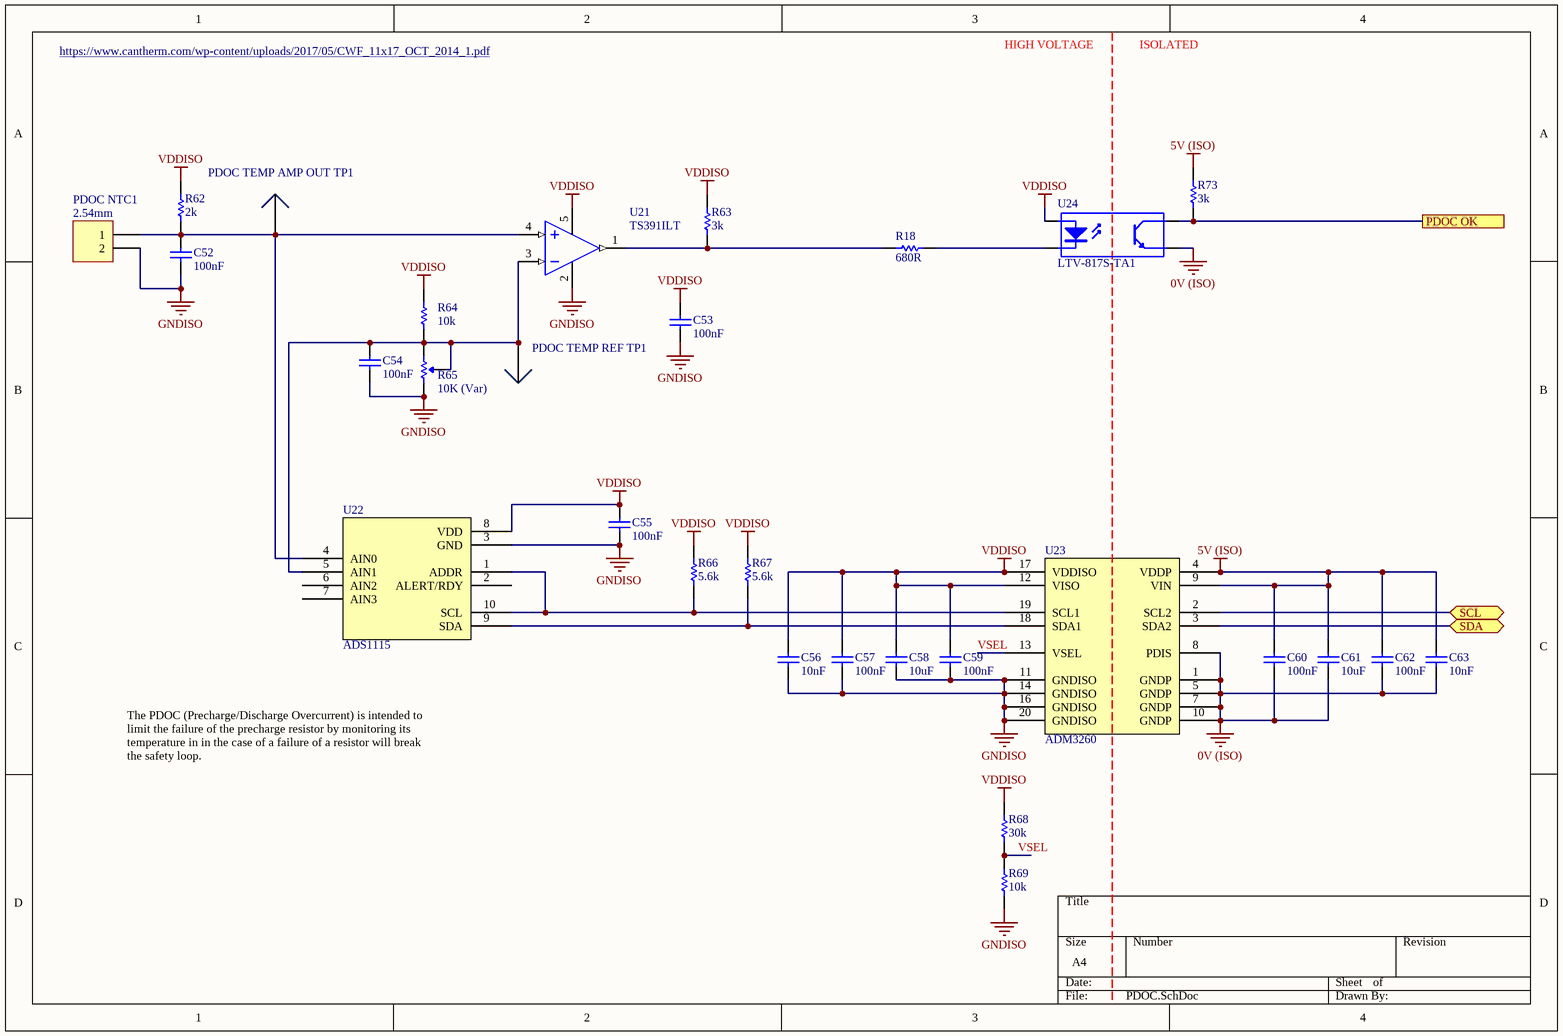
[diagram p6: PDOC.SchDoc]

### Parts
C52  100nF  [0805]
C53  100nF  [0805]
C54  100nF  [0805]
C55  100nF  [0805]
C56  10nF  [0805]
C57  100nF  [0805]
C58  10uF  [0805]
C59  100nF  [0805]
C60  100nF  [0805]
C61  10uF  [0805]
C62  100nF  [0805]
C63  10nF  [0805]
PDOC_NTC1  2.54mm  [TH 2.54mm Header 1x2]
PDOC_TEMP_AMP_OUT_TP1  0mm  [SMD Test Point]  (value not drawn)
PDOC_TEMP_REF_TP1  0mm  [SMD Test Point]  (value not drawn)
R18  680R  [0805]
R62  2k  [0805]
R63  3k  [0805]
R64  10k  [0805]
R65  10K (Var)  [B 3296]
R66  5.6k  [0805]
R67  5.6k  [0805]
R68  30k  [0805]
R69  10k  [0805]
R73  3k  [0805]
U21  TS391ILT  [ON SOT-23-5]
U22  ADS1115  [TI 10-VSSOP]
U23  ADM3260  [AD 20-SSOP]
U24  LTV-817S-TA1  [ON 4-SMD]

### Ports
PDOC OK, SCL (bidir), SDA (bidir)

### Nets
0V (ISO): C60.1 C61.1 C62.1 C63.1 U23.1(GNDP) U23.5(GNDP) U23.7(GNDP) U23.8(PDIS) U23.10(GNDP) U24.3(E)
5V (ISO): C60.2 C61.2 C62.2 C63.2 R73.2 U23.4(VDDP) U23.9(VIN)
GNDISO: C52.1 C53.1 C54.1 C55.2 C56.1 C57.1 C58.1 C59.2 PDOC_NTC1.2 R65.3(CW) R69.1 U21.2(VCC-) U22.3(GND) U23.11(GNDISO) U23.14(GNDISO) U23.16(GNDISO) U23.20(GNDISO)  [project net HV Battery-]
VDDISO: C53.2 C55.1 C56.2 C57.2 C58.2 C59.1 R62.2 R63.2 R64.2 R66.2 R67.2 R68.2 U21.5(VCC+) U22.8(VDD) U23.12(VISO) U23.17(VDDISO) U24.1(A)
PDOC OK (ISO): R73.1 U24.4(C) ; port PDOC OK
SCL: U23.2(SCL2) ; port SCL
SDA: U23.3(SDA2) ; port SDA
VSEL: R68.1 R69.2 U23.13(VSEL)
NetC52_2: C52.2 PDOC_NTC1.1 PDOC_TEMP_AMP_OUT_TP1.1 R62.1 U21.4(IIN+) U22.4(AIN0)
NetC54_2: C54.2 PDOC_TEMP_REF_TP1.1 R64.1 R65.1(CCW) R65.2(Wiper) U21.3(IN-) U22.5(AIN1)
NetR18_1: R18.1 R63.1 U21.1(OUT)
NetR18_2: R18.2 U24.2(K)
NetR66_1: R66.1 U22.1(ADDR) U22.10(SCL) U23.19(SCL1)
NetR67_1: R67.1 U22.9(SDA) U23.18(SDA1)

Not connected (* = marked no-connect by the designer): U22 2(ALERT/RDY) 6(AIN2) 7(AIN3)

### Notes on the sheet
- https://www.cantherm.com/wp-content/uploads/2017/05/CWF_11x17_OCT_2014_1.pdf
- HIGH VOLTAGE
- ISOLATED
- The PDOC (Precharge/Discharge Overcurrent) is intended to limit the failure of the precharge resistor by monitoring its temperature in in the case of a failure of a resistor will break the safety loop.

### Library data of the parts
C52-C55 C57 C59 C60 C62 = GCM21BR71E104KA37L: as C2 on sheet CAN; Part Number: GCM21BR71E104KA37L; Value: 100nF
C56 C63 = GCM21BR71H103KA37L: as C31 on sheet HV Sense; Part Number: GCM21BR71H103KA37L; Value: 10nF
C58 C61 = GRM21BR6YA106KE43L: as C5 on sheet CAN; Part Number: GRM21BR6YA106KE43L; Value: 10uF; Digikey Part Number: 490-10514-6-ND
PDOC_NTC1 = TH 2.54mm Header 1x2: Positions: 2; Angle: 0; Flange: No; Contact: NA; Part Number: TH 2.54mm Header 1x2; Pitch: 2.54mm; Row Spacing: 2.54mm
PDOC_TEMP_AMP_OUT_TP1 PDOC_TEMP_REF_TP1 = SMD Test Point: as CAN_RX_TP on sheet CAN; Part Number: SMD Test Point; Pitch: 0mm; Angle: 0
R18 = RC0805FR07680RL: as R2 on sheet Power Supply; Part Number: RC0805FR07680RL; Value: 680R; Material: FR-07
R62 = RC0805FR072KL: Manufacturer: YAGEO; Tolerance: 0.01; Rated Voltage: 0.125W; Part Number: RC0805FR072KL; Value: 2k; Material: FR-07
R63 R73 = RC0805FR073KL: Manufacturer: YAGEO; Tolerance: 0.01; Rated Voltage: 0.125W; Part Number: RC0805FR073KL; Value: 3k; Material: FR-07
R64 R69 = RC0805FR0710KL: as R53 on sheet HV Sense; Part Number: RC0805FR0710KL; Value: 10k; Material: FR-07
R65 = 3296W-1-103LF: as R48 on sheet HV Sense; Part Number: 3296W-1-103LF; Value: 10K (Var); Digikey Part Number: 3296W-103LF-ND
R66 R67 = RC0805FR075K6L: as R49 on sheet HV Sense; Part Number: RC0805FR075K6L; Value: 5.6k; Material: FR-07
R68 = RC0805FR0730KL: as R52 on sheet HV Sense; Part Number: RC0805FR0730KL; Value: 30k; Material: FR-07
U21 = TS391ILT: IC COMP LO PWR SGL V SOT 23-5L; Manufacturer: STMicroelectronics; Part Number: TS391ILT; Digikey Part Number: 497-2275-2-ND; Digikey Link: https://www.digikey.com/product-detail/en/stmicroelectronics/TS391ILT/497-2275-2-ND/599407
U22 = ADS1115: as U17 on sheet HV Sense; Part Number: ADS1115; Digikey Part Number: 296-38849-1-ND; Digikey Link: https://www.digikey.com/product-detail/en/texas-instruments/ADS1115IDGSR/296-38849-1-ND/5142969
U23 = ADM3260: as U18 on sheet HV Sense; Part Number: ADM3260; Digikey Part Number: ADM3260ARSZ-RL7CT-ND; Digikey Link: https://www.digikey.com/product-detail/en/analog-devices-inc/ADM3260ARSZ-RL7/ADM3260ARSZ-RL7CT-ND/5233040
U24 = LTV-817S-TA1: as U14 on sheet Safety Loops; Part Number: LTV-817S-TA1; Digikey Part Number: 160-1893-2-ND; Digikey Link: https://www.digikey.com/product-detail/en/lite-on-inc/LTV-817S-TA1/160-1893-2-ND/388451

## Sheet Digital Isolation.SchDoc
size A4
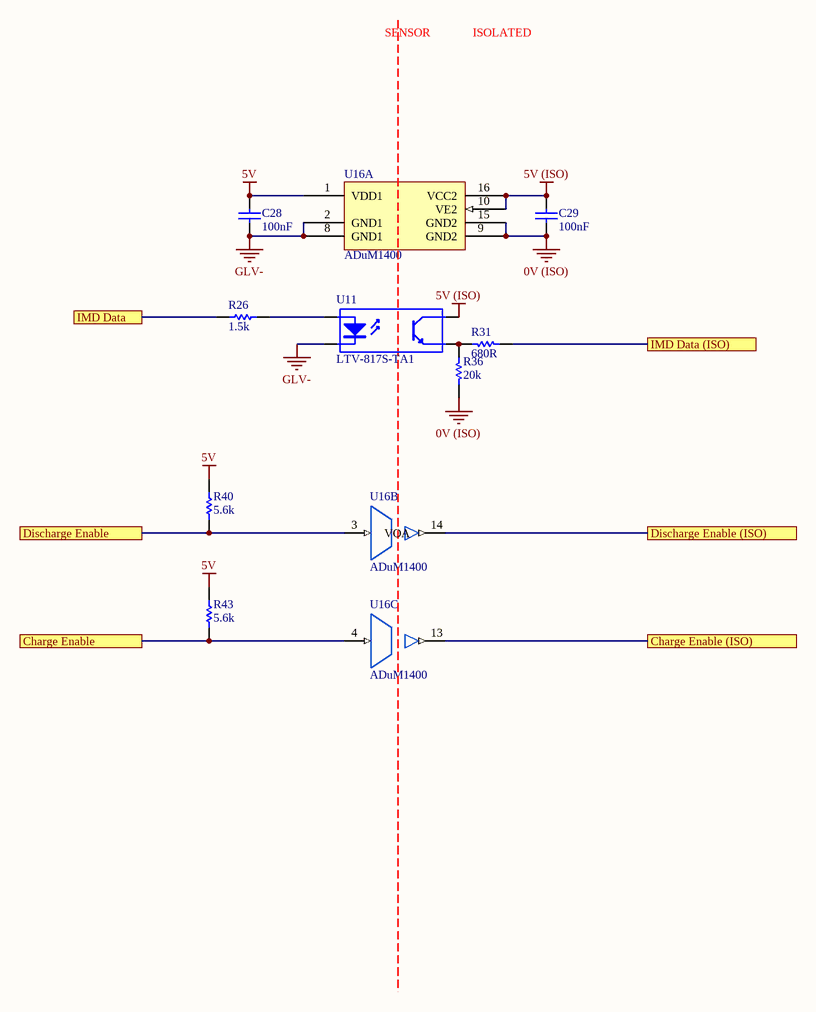
[diagram p7: Digital Isolation.SchDoc]

### Parts
C28  100nF  [0805]
C29  100nF  [0805]
R26  1.5k  [0805]
R31  680R  [0805]
R36  20k  [0805]
R40  5.6k  [0805]
R43  5.6k  [0805]
U11  LTV-817S-TA1  [ON 4-SMD]
U16  ADuM1400  [AD 16-SOIC]  (parts A,B,C of 5)

### Ports
Charge Enable, Charge Enable (ISO), Discharge Enable, Discharge Enable (ISO), IMD Data, IMD Data (ISO)

### Nets
0V (ISO): C29.1 R36.1 U16.9(GND2) U16.15(GND2)
5V: C28.2 R40.2 R43.2 U16.1(VDD1)
5V (ISO): C29.2 U11.4(C) U16.10(VE2) U16.16(VCC2)
GLV-: C28.1 U11.2(K) U16.2(GND1) U16.8(GND1)
Charge Enable: R43.1 U16.4(VIB) ; port Charge Enable
Charge Enable (ISO): U16.13(VOB) ; port Charge Enable (ISO)
Discharge Enable: R40.1 U16.3(VIA) ; port Discharge Enable
Discharge Enable (ISO): U16.14(VOA) ; port Discharge Enable (ISO)
IMD Data: R26.1 ; port IMD Data
IMD Data (ISO): R31.1 ; port IMD Data (ISO)
NetR26_2: R26.2 U11.1(A)
NetR31_2: R31.2 R36.2 U11.3(E)

### Notes on the sheet
- SENSOR
- ISOLATED

### Library data of the parts
C28 C29 = GCM21BR71E104KA37L: as C2 on sheet CAN; Part Number: GCM21BR71E104KA37L; Value: 100nF
R26 = RC0805FR071K5L: as R30 on sheet Safety Loops; Part Number: RC0805FR071K5L; Value: 1.5k; Material: FR-07
R31 = RC0805FR07680RL: as R2 on sheet Power Supply; Part Number: RC0805FR07680RL; Value: 680R; Material: FR-07
R36 = RC0805FR0720KL: as R29 on sheet Safety Loops; Part Number: RC0805FR0720KL; Value: 20k; Material: FR-07
R40 R43 = RC0805FR075K6L: as R49 on sheet HV Sense; Part Number: RC0805FR075K6L; Value: 5.6k; Material: FR-07
U11 = LTV-817S-TA1: as U14 on sheet Safety Loops; Part Number: LTV-817S-TA1; Digikey Part Number: 160-1893-2-ND; Digikey Link: https://www.digikey.com/product-detail/en/lite-on-inc/LTV-817S-TA1/160-1893-2-ND/388451
U16 = ADuM1400: as U16 on sheet Precharge; Part Number: ADuM1400; Digikey Part Number: ADUM1400WSRWZ-ND; Digikey Link: https://www.digikey.com/product-detail/en/analog-devices-inc/ADUM1400WSRWZ/ADUM1400WSRWZ-ND/1873713

## Sheet Microcontroller.SchDoc
size A3
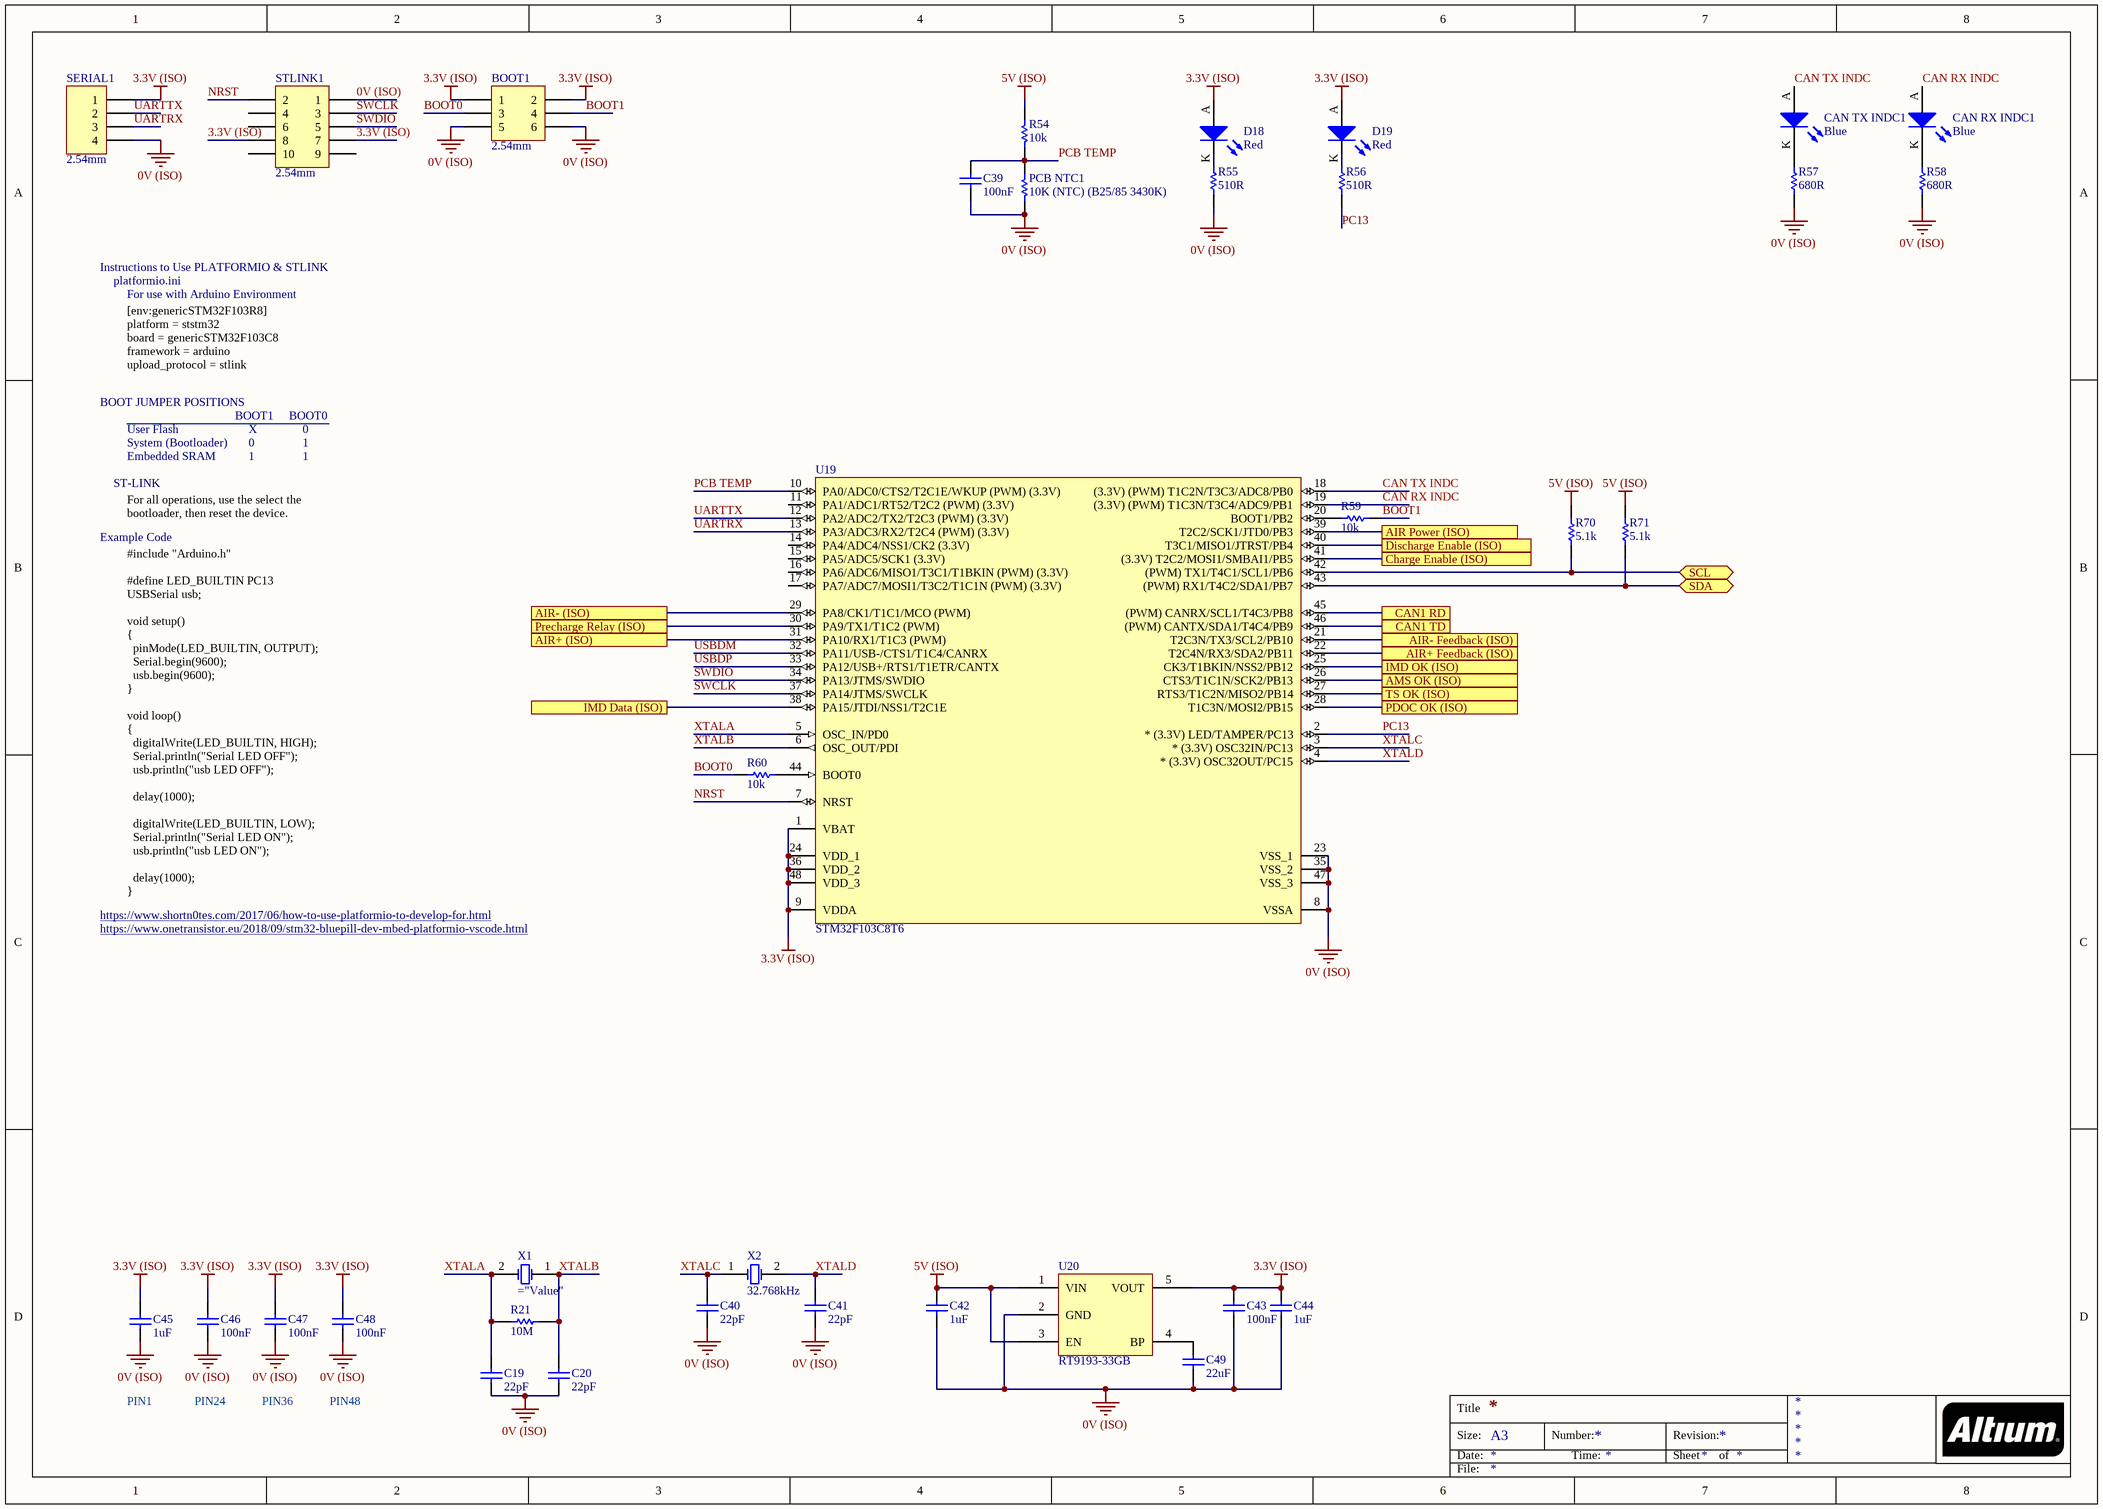
[diagram p8: Microcontroller.SchDoc]

### Parts
BOOT1  2.54mm  [TH 2.54mm Header 2x3]
C19  22pF  [0805]
C20  22pF  [0805]
C39  100nF  [0805]
C40  22pF  [0805]
C41  22pF  [0805]
C42  1uF  [0805]
C43  100nF  [0805]
C44  1uF  [0805]
C45  1uF  [0805]
C46  100nF  [0805]
C47  100nF  [0805]
C48  100nF  [0805]
C49  22uF  [0805]
CAN_RX_INDC1  Blue  [0805 LED]
CAN_TX_INDC1  Blue  [0805 LED]
D18  Red  [0805 LED]
D19  Red  [0805 LED]
PCB_NTC1  10K (NTC) (B25/85 3430K)  [0805]
R21  10M  [0805]
R54  10k  [0805]
R55  510R  [0805]
R56  510R  [0805]
R57  680R  [0805]
R58  680R  [0805]
R59  10k  [0805]
R60  10k  [0805]
R70  5.1k  [0805]
R71  5.1k  [0805]
SERIAL1  2.54mm  [TH 2.54mm Header 1x4]
STLINK1  2.54mm  [TH 2.54mm Header 2x5]
U19  STM32F103C8T6  [STM 48-LQFP]
U20  RT9193-33GB  [RICHTEK SOT-23-5]
X1  (no value)  [Abracon HC-49/US]
X2  32.768kHz  [EPSON 2-SMD]

### Ports
AIR Power (ISO), AIR+ (ISO), AIR+ Feedback (ISO), AIR- (ISO), AIR- Feedback (ISO), AMS OK (ISO), CAN1 RD, CAN1 TD, Charge Enable (ISO), Discharge Enable (ISO), IMD Data (ISO), IMD OK (ISO), PDOC OK (ISO), Precharge Relay (ISO), SCL (bidir), SDA (bidir), TS OK (ISO)

### Nets
0V (ISO): BOOT1.5 BOOT1.6 C19.1 C20.1 C39.1 C40.1 C41.1 C42.1 C43.1 C44.1 C45.1 C46.1 C47.1 C48.1 C49.1 PCB_NTC1.1 R55.1 R57.1 R58.1 SERIAL1.4 STLINK1.1 U19.8(VSSA) U19.23(VSS_1) U19.35(VSS_2) U19.47(VSS_3) U20.2(GND)
3.3V (ISO): BOOT1.1 BOOT1.2 C43.2 C44.2 C45.2 C46.2 C47.2 C48.2 D18.A D19.A SERIAL1.1 STLINK1.7 STLINK1.8 U19.1(VBAT) U19.9(VDDA) U19.24(VDD_1) U19.36(VDD_2) U19.48(VDD_3) U20.5(VOUT)
5V (ISO): C42.2 R54.2 R70.2 R71.2 U20.1(VIN) U20.3(EN)
AIR+ (ISO): U19.31(PA10/RX1/T1C3_(PWM)) ; port AIR+ (ISO)
AIR+ Feedback (ISO): U19.22(T2C4N/RX3/SDA2/PB11) ; port AIR+ Feedback (ISO)
AIR- (ISO): U19.29(PA8/CK1/T1C1/MCO_(PWM)) ; port AIR- (ISO)
AIR- Feedback (ISO): U19.21(T2C3N/TX3/SCL2/PB10) ; port AIR- Feedback (ISO)
AMS OK (ISO): U19.26(CTS3/T1C1N/SCK2/PB13) ; port AMS OK (ISO)
BOOT0: BOOT1.3 R60.1
BOOT1: BOOT1.4 R59.2
CAN RX: U19.45((PWM)_CANRX/SCL1/T4C3/PB8) ; port CAN1 RD
CAN RX INDC: CAN_RX_INDC1.A U19.19((3.3V)_(PWM)_T1C3N/T3C4/ADC9/PB1)
CAN TX: U19.46((PWM)_CANTX/SDA1/T4C4/PB9) ; port CAN1 TD
CAN TX INDC: CAN_TX_INDC1.A U19.18((3.3V)_(PWM)_T1C2N/T3C3/ADC8/PB0)
Charge Enable (ISO): U19.41((3.3V)_T2C2/MOSI1/SMBAI1/PB5) ; port Charge Enable (ISO)
Discharge Enable (ISO): U19.40(T3C1/MISO1/JTRST/PB4) ; port Discharge Enable (ISO)
IMD Data (ISO): U19.38(PA15/JTDI/NSS1/T2C1E) ; port IMD Data (ISO)
IMD OK (ISO): U19.25(CK3/T1BKIN/NSS2/PB12) ; port IMD OK (ISO)
NRST: STLINK1.2 U19.7(NRST)
PC13: R56.1 U19.2(*_(3.3V)_LED/TAMPER/PC13)
PCB TEMP: C39.2 PCB_NTC1.2 R54.1 U19.10(PA0/ADC0/CTS2/T2C1E/WKUP_(PWM)_(3.3V))
PDOC OK (ISO): U19.28(T1C3N/MOSI2/PB15) ; port PDOC OK (ISO)
Precharge Relay (ISO): U19.30(PA9/TX1/T1C2_(PWM)) ; port Precharge Relay (ISO)
SCL: R70.1 U19.42((PWM)_TX1/T4C1/SCL1/PB6) ; port SCL
SDA: R71.1 U19.43((PWM)_RX1/T4C2/SDA1/PB7) ; port SDA
SWCLK: STLINK1.3 U19.37(PA14/JTMS/SWCLK)
SWDIO: STLINK1.5 U19.34(PA13/JTMS/SWDIO)
TS OK (ISO): U19.27(RTS3/T1C2N/MISO2/PB14) ; port TS OK (ISO)
UARTRX: SERIAL1.3 U19.13(PA3/ADC3/RX2/T2C4_(PWM)_(3.3V))
UARTTX: SERIAL1.2 U19.12(PA2/ADC2/TX2/T2C3_(PWM)_(3.3V))
USBDM: U19.32(PA11/USB-/CTS1/T1C4/CANRX)
USBDP: U19.33(PA12/USB+/RTS1/T1ETR/CANTX)
XTALA: C19.2 R21.2 U19.5(OSC_IN/PD0) X1.2(OSC2)
XTALB: C20.2 R21.1 U19.6(OSC_OUT/PDI) X1.1(OSC1)
XTALC: C40.2 U19.3(*_(3.3V)_OSC32IN/PC13) X2.1(OSC1)
XTALD: C41.2 U19.4(*_(3.3V)_OSC32OUT/PC15) X2.2(OSC2)
NetAIR_POW_TP1_1: U19.39(T2C2/SCK1/JTD0/PB3) ; port AIR Power (ISO)
NetC49_2: C49.2 U20.4(BP)
NetCAN_RX_INDC1_K: CAN_RX_INDC1.K R58.2
NetCAN_TX_INDC1_K: CAN_TX_INDC1.K R57.2
NetD18_K: D18.K R55.2
NetD19_K: D19.K R56.2
NetR59_1: R59.1 U19.20(BOOT1/PB2)
NetR60_2: R60.2 U19.44(BOOT0)

Not connected (* = marked no-connect by the designer): STLINK1 4 6 9 10; U19 11(PA1/ADC1/RT52/T2C2_(PWM)_(3.3V)) 14(PA4/ADC4/NSS1/CK2_(3.3V)) 15(PA5/ADC5/SCK1_(3.3V)) 16(PA6/ADC6/MISO1/T3C1/T1BKIN_(PWM)_(3.3V)) 17(PA7/ADC7/MOSI1/T3C2/T1C1N_(PWM)_(3.3V))

### Notes on the sheet
- Instructions to Use PLATFORMIO & STLINK
- platformio.ini
- For use with Arduino Environment
- BOOT JUMPER POSITIONS
- [env:genericSTM32F103R8]
  platform = ststm32
  board = genericSTM32F103C8
  framework = arduino
  upload_protocol = stlink
- User Flash
- System (Bootloader)
- BOOT1
- X
- 0
- BOOT0
- 1
- ST-LINK
- Embedded SRAM
- For all operations, use the select the bootloader, then reset the device.
- Example Code
- https://www.shortn0tes.com/2017/06/how-to-use-platformio-to-develop-for.html
- #include "Arduino.h"
  #define LED_BUILTIN PC13
  USBSerial usb;
  void setup()
  {
  pinMode(LED_BUILTIN, OUTPUT);
  Serial.begin(9600);
  usb.begin(9600);
  }
  void loop()
  {
  digitalWrite(LED_BUILTIN, HIGH);
  Serial.println("Serial LED OFF");
  usb.println("usb LED OFF");
  delay(1000);
  digitalWrite(LED_BUILTIN, LOW);
  Serial.println("Serial LED ON");
  usb.println("usb LED ON");
  delay(1000);
  }
- https://www.onetransistor.eu/2018/09/stm32-bluepill-dev-mbed-platformio-vscode.html
- PIN1
- PIN24
- PIN36
- PIN48
- Title
- Size:
- Date:
- A3
- Number:
- Time:
- Revision:
- Sheet
- of
- File:

### Library data of the parts
BOOT1 = TH 2.54mm Header 2x3: Positions: 6; Angle: 0; Flange: No; Contact: NA; Part Number: TH 2.54mm Header 2x3; Pitch: 2.54mm; Row Spacing: 2.54mm
C19 C20 C40 C41 = GCM21B5C1H220JA37L: as C9 on sheet CAN; Part Number: GCM21B5C1H220JA37L; Value: 22pF
C39 C43 C46-C48 = GCM21BR71E104KA37L: as C2 on sheet CAN; Part Number: GCM21BR71E104KA37L; Value: 100nF
C42 C44 C45 = GCM21BR71A105KA37L: Manufacturer: muRata; Tolerance: 10%; Material: X7R; Rated Voltage: 10V; Part Number: GCM21BR71A105KA37L; Value: 1uF
C49 = GRM21BR61A226ME51L: Manufacturer: muRata; Tolerance: 20%; Material: X5R; Rated Voltage: 10V; Part Number: GRM21BR61A226ME51L; Value: 22uF; Digikey Part Number: 490-10511-1-ND
CAN_RX_INDC1 CAN_TX_INDC1 = SML-MN2BCTT86C: LED BLUE CLEAR 2012 SMD; Manufacturer: ROHM Semiconductor; Part Number: SML-MN2BCTT86C; Colour: Blue; Digikey Part Number: 846-1207-1-ND; Digikey Link: https://www.digikey.com/product-detail/en/rohm-semiconductor/SMLMN2BCTT86C/846-1207-1-ND/6057239
D18 D19 = SML-210LTT86: as D16 on sheet Power Supply; Part Number: SML-210LTT86; Colour: Red; Digikey Part Number: 511-1286-1-ND; Digikey Link: https://www.digikey.com/product-detail/en/rohm-semiconductor/SML-210LTT86/511-1286-1-ND/637099
PCB_NTC1 = NTCS0805E3103FLT: Manufacturer: Vishay Beyschlag; Tolerance: 0.01; Rated Voltage: 210mW; Part Number: NTCS0805E3103FLT; Value: 10K (NTC) (B25/85 3430K); Digikey Part Number: BC2733CT-ND
R21 = RC0805FR0710ML: Manufacturer: YAGEO; Tolerance: 0.01; Rated Voltage: 0.125W; Part Number: RC0805FR0710ML; Value: 10M; Material: FR-07
R54 R59 R60 = RC0805FR0710KL: as R53 on sheet HV Sense; Part Number: RC0805FR0710KL; Value: 10k; Material: FR-07
R55 R56 = RC0805FR07510RL: as R3 on sheet Power Supply; Part Number: RC0805FR07510RL; Value: 510R; Material: FR-07
R57 R58 = RC0805FR07680RL: as R2 on sheet Power Supply; Part Number: RC0805FR07680RL; Value: 680R; Material: FR-07
R70 R71 = RC0805FR075K1L: Manufacturer: YAGEO; Tolerance: 0.01; Rated Voltage: 0.125W; Part Number: RC0805FR075K1L; Value: 5.1k; Material: FR-07
SERIAL1 = TH 2.54mm Header 1x4: Positions: 4; Angle: 0; Flange: No; Contact: NA; Part Number: TH 2.54mm Header 1x4; Pitch: 2.54mm; Row Spacing: 2.54mm
STLINK1 = TH 2.54mm Header 2x5: Positions: 10; Angle: 0; Flange: No; Contact: NA; Part Number: TH 2.54mm Header 2x5; Pitch: 2.54mm; Row Spacing: 2.54mm
U19 = STM32F103C8T6: ARM® Cortex®-M3 STM32F1 Microcontroller IC 32-Bit 72MHz 64KB (64K x 8) FLASH; Manufacturer: STMicroelectronics; Part Number: STM32F103C8T6; Digikey Part Number: 497-6063-ND; Digikey Link: https://www.digikey.com/product-detail/en/stmicroelectronics/STM32F103C8T6/497-6063-ND/1646338
U20 = RT9193-33GB: IC REG LINEAR 3.3V 300MA SOT23-5; Manufacturer: Richtek; Part Number: RT9193-33GB; Digikey Part Number: 1028-1014-1-ND; Digikey Link: https://www.digikey.com/products/en?keywords=1028-1014-1-ND
X1 = ABLS-16.000MHZ-B4-T: Manufacturer: Abracon LLC; Load Capacitance: 18pF; ESR: 40R; Part Number: ABLS-16.000MHZ-B4-T; Digikey Part Number: 535-10226-1-ND; Digikey Link: https://www.digikey.com/product-detail/en/abracon-llc/ABLS-16.000MHZ-B4-T/535-10226-1-ND/2184261
X2 = FC-135 32.7680KA-A5: Manufacturer: EPSON; Load Capacitance: 12.5pF; ESR: 70k; Part Number: FC-135 32.7680KA-A5; Value: 32.768kHz; Digikey Part Number: SER4103TR-ND; Digikey Link: https://www.digikey.com/product-detail/en/epson/FC-135-32.7680KA-A5/SER4103TR-ND/5259895